# Altium project Solens.PrjPCB
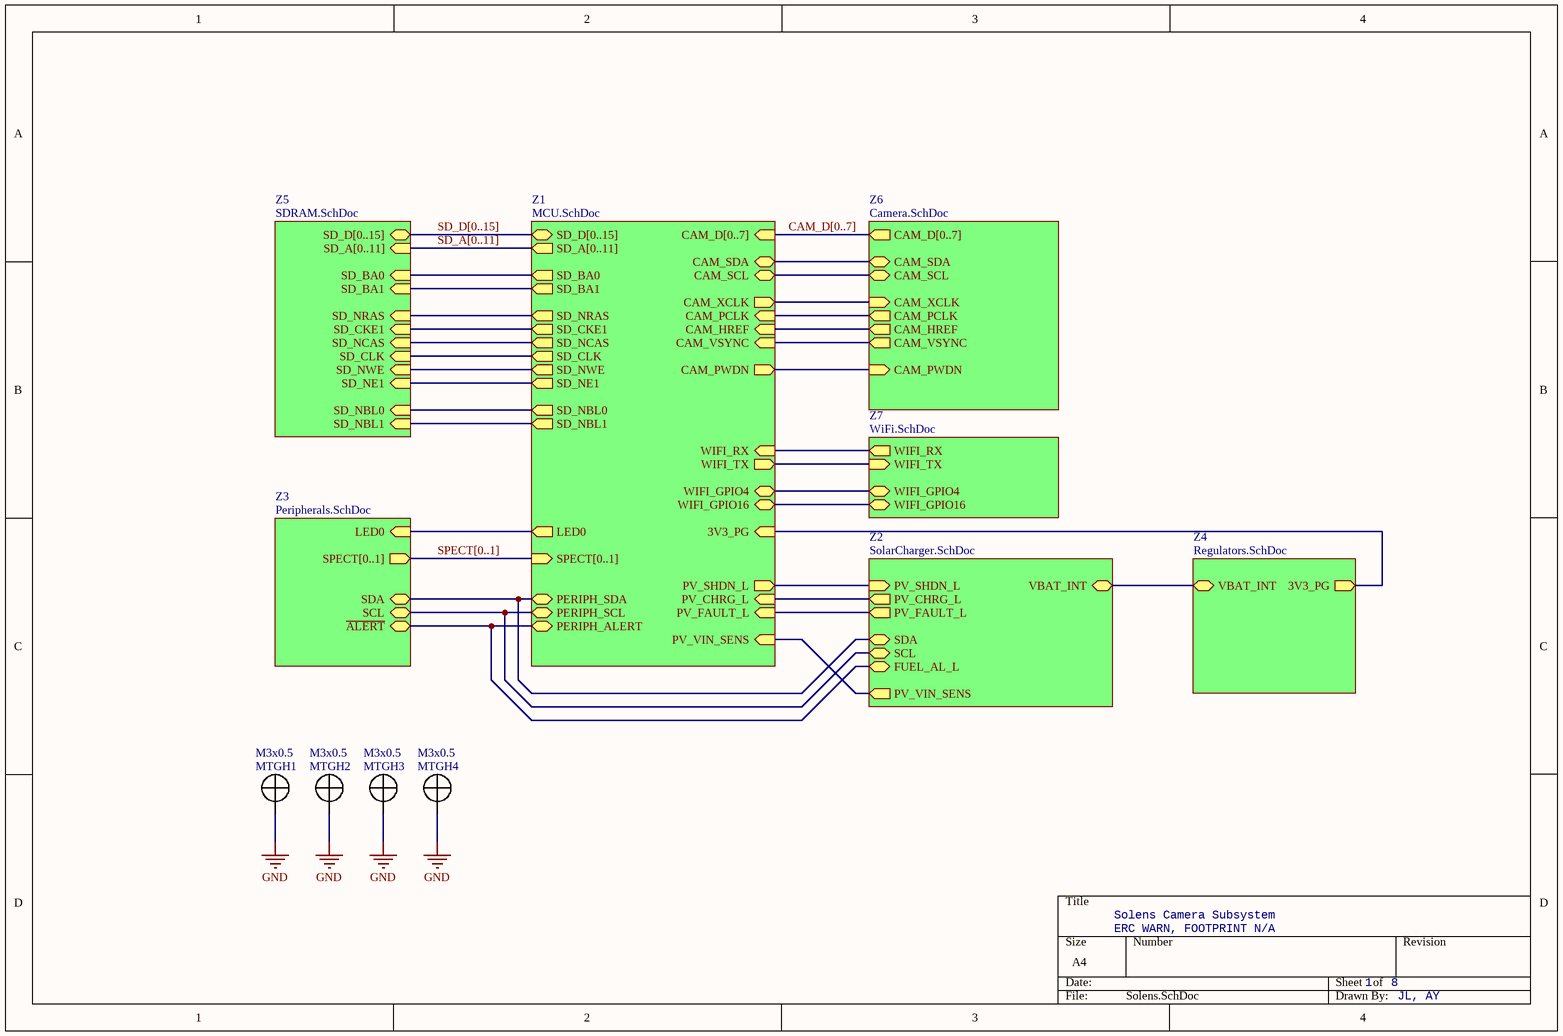
[diagram p0: Solens.SchDoc]
8 sheets, 208 parts. Net scope: hierarchical (ports join the sheet entries above them; power ports are global).
Board file: Solens.PcbDoc
Sheets:
  Solens.SchDoc
    Z2 = SolarCharger.SchDoc
    Z4 = Regulators.SchDoc
    Z5 = SDRAM.SchDoc
    Z1 = MCU.SchDoc
    Z3 = Peripherals.SchDoc
    Z6 = Camera.SchDoc
    Z7 = WiFi.SchDoc

## Sheet Solens.SchDoc
size A4; DocumentNumber: 1; SheetNumber: 1; SheetTotal: 8

### Parts
MTGH1  ScrewSize: M3x0.5  [MTGH-M3x0.5-ClipSW]  (hidden comment: M3x0.5 (DNP))
MTGH2  ScrewSize: M3x0.5  [MTGH-M3x0.5-ClipNW]  (hidden comment: M3x0.5 (DNP))
MTGH3  ScrewSize: M3x0.5  [MTGH-M3x0.5-ClipNE]  (hidden comment: M3x0.5 (DNP))
MTGH4  ScrewSize: M3x0.5  [MTGH-M3x0.5]  (hidden comment: M3x0.5 (DNP))

### Sub-sheets
Z1 = MCU.SchDoc: CAM_SDA (bidir), CAM_SCL (bidir), CAM_XCLK (out), CAM_PCLK (in), CAM_HREF (in), SD_NBL0 (out), SD_NBL1 (out), SD_NRAS (out), SD_CKE1 (out), SD_NCAS (out), SD_CLK (out), SD_NWE (out), SD_NE1 (out), SD_BA1 (out), SD_BA0 (out), CAM_VSYNC (in), CAM_PWDN (out), PERIPH_SDA (bidir), PERIPH_ALERT (bidir), PERIPH_SCL (bidir), WIFI_RX (in), WIFI_TX (out), PV_FAULT_L (in), PV_CHRG_L (in), 3V3_PG (in), PV_SHDN_L (out), SD_D[0..15] (bidir), SD_A[0..11] (out), CAM_D[0..7] (in), SPECT[0..1] (in), LED0 (out), PV_VIN_SENS (in), WIFI_GPIO16 (bidir), WIFI_GPIO4 (bidir)
Z2 = SolarCharger.SchDoc: SCL (bidir), SDA (bidir), PV_FAULT_L (out), PV_CHRG_L (out), PV_SHDN_L (in), FUEL_AL_L (bidir), VBAT_INT, PV_VIN_SENS (out)
Z3 = Peripherals.SchDoc: SDA (bidir), ~{ALERT} (bidir), SCL (bidir), SPECT[0..1] (out), LED0 (in)
Z4 = Regulators.SchDoc: 3V3_PG (out), VBAT_INT
Z5 = SDRAM.SchDoc: SD_BA0 (in), SD_BA1 (in), SD_NE1 (in), SD_NWE (in), SD_NRAS (in), SD_NCAS (in), SD_CLK (in), SD_CKE1 (in), SD_NBL1 (in), SD_NBL0 (in), SD_D[0..15] (bidir), SD_A[0..11] (in)
Z6 = Camera.SchDoc: CAM_PCLK (out), CAM_XCLK (in), CAM_HREF (out), CAM_VSYNC (out), CAM_PWDN (in), CAM_SDA (bidir), CAM_SCL (bidir), CAM_D[0..7] (out)
Z7 = WiFi.SchDoc: WIFI_TX (in), WIFI_RX (out), WIFI_GPIO4 (bidir), WIFI_GPIO16 (bidir)

### Nets
GND: MTGH1.1 MTGH2.1 MTGH3.1 MTGH4.1
3V3_PG: sheet Z4/3V3_PG, sheet Z1/3V3_PG
CAM_HREF: sheet Z1/CAM_HREF, sheet Z6/CAM_HREF
CAM_PCLK: sheet Z1/CAM_PCLK, sheet Z6/CAM_PCLK
CAM_PWDN: sheet Z1/CAM_PWDN, sheet Z6/CAM_PWDN
CAM_SCL: sheet Z1/CAM_SCL, sheet Z6/CAM_SCL
CAM_SDA: sheet Z1/CAM_SDA, sheet Z6/CAM_SDA
CAM_VSYNC: sheet Z1/CAM_VSYNC, sheet Z6/CAM_VSYNC
CAM_XCLK: sheet Z1/CAM_XCLK, sheet Z6/CAM_XCLK
I2C2_ALERT: sheet Z2/FUEL_AL_L, sheet Z1/PERIPH_ALERT, sheet Z3/~{ALERT}
I2C2_SCL: sheet Z2/SCL, sheet Z1/PERIPH_SCL, sheet Z3/SCL
I2C2_SDA: sheet Z2/SDA, sheet Z1/PERIPH_SDA, sheet Z3/SDA
LED0: sheet Z1/LED0, sheet Z3/LED0
PV_SHDN_L: sheet Z2/PV_SHDN_L, sheet Z1/PV_SHDN_L
PV_VIN_SENS: sheet Z2/PV_VIN_SENS, sheet Z1/PV_VIN_SENS
PWR_CHRG_L: sheet Z2/PV_CHRG_L, sheet Z1/PV_CHRG_L
PWR_FAULT_L: sheet Z2/PV_FAULT_L, sheet Z1/PV_FAULT_L
SD_BA0: sheet Z5/SD_BA0, sheet Z1/SD_BA0
SD_BA1: sheet Z5/SD_BA1, sheet Z1/SD_BA1
SD_CKE1: sheet Z5/SD_CKE1, sheet Z1/SD_CKE1
SD_CLK: sheet Z5/SD_CLK, sheet Z1/SD_CLK
SD_NBL0: sheet Z5/SD_NBL0, sheet Z1/SD_NBL0
SD_NBL1: sheet Z5/SD_NBL1, sheet Z1/SD_NBL1
SD_NCAS: sheet Z5/SD_NCAS, sheet Z1/SD_NCAS
SD_NE1: sheet Z5/SD_NE1, sheet Z1/SD_NE1
SD_NRAS: sheet Z5/SD_NRAS, sheet Z1/SD_NRAS
SD_NWE: sheet Z5/SD_NWE, sheet Z1/SD_NWE
VBAT_INT: sheet Z2/VBAT_INT, sheet Z4/VBAT_INT
WIFI_GPIO4: sheet Z1/WIFI_GPIO4, sheet Z7/WIFI_GPIO4
WIFI_GPIO16: sheet Z1/WIFI_GPIO16, sheet Z7/WIFI_GPIO16
WIFI_RX: sheet Z1/WIFI_RX, sheet Z7/WIFI_RX
WIFI_TX: sheet Z1/WIFI_TX, sheet Z7/WIFI_TX

### Buses and harness runs
bus CAM_D[0..7] = sheet Z1/CAM_D[0..7] = sheet Z6/CAM_D[0..7]
bus SD_A[0..11] = sheet Z1/SD_A[0..11] = sheet Z5/SD_A[0..11]
bus SD_D[0..15] = sheet Z1/SD_D[0..15] = sheet Z5/SD_D[0..15]
bus SPECT[0..1] = sheet Z1/SPECT[0..1] = sheet Z3/SPECT[0..1]

### Notes on the sheet
- Solens Camera Subsystem
- ERC WARN, FOOTPRINT N/A
- JL, AY

### Library data of the parts
MTGH1-MTGH4 = MTGH: Mounting hole; DigikeyPN: 36-9923-ND; DNP: DNP; Value: M3x0.5 (DNP)

## Sheet SolarCharger.SchDoc
size A4; DocumentNumber: 2; SheetNumber: 2; SheetTotal: 8
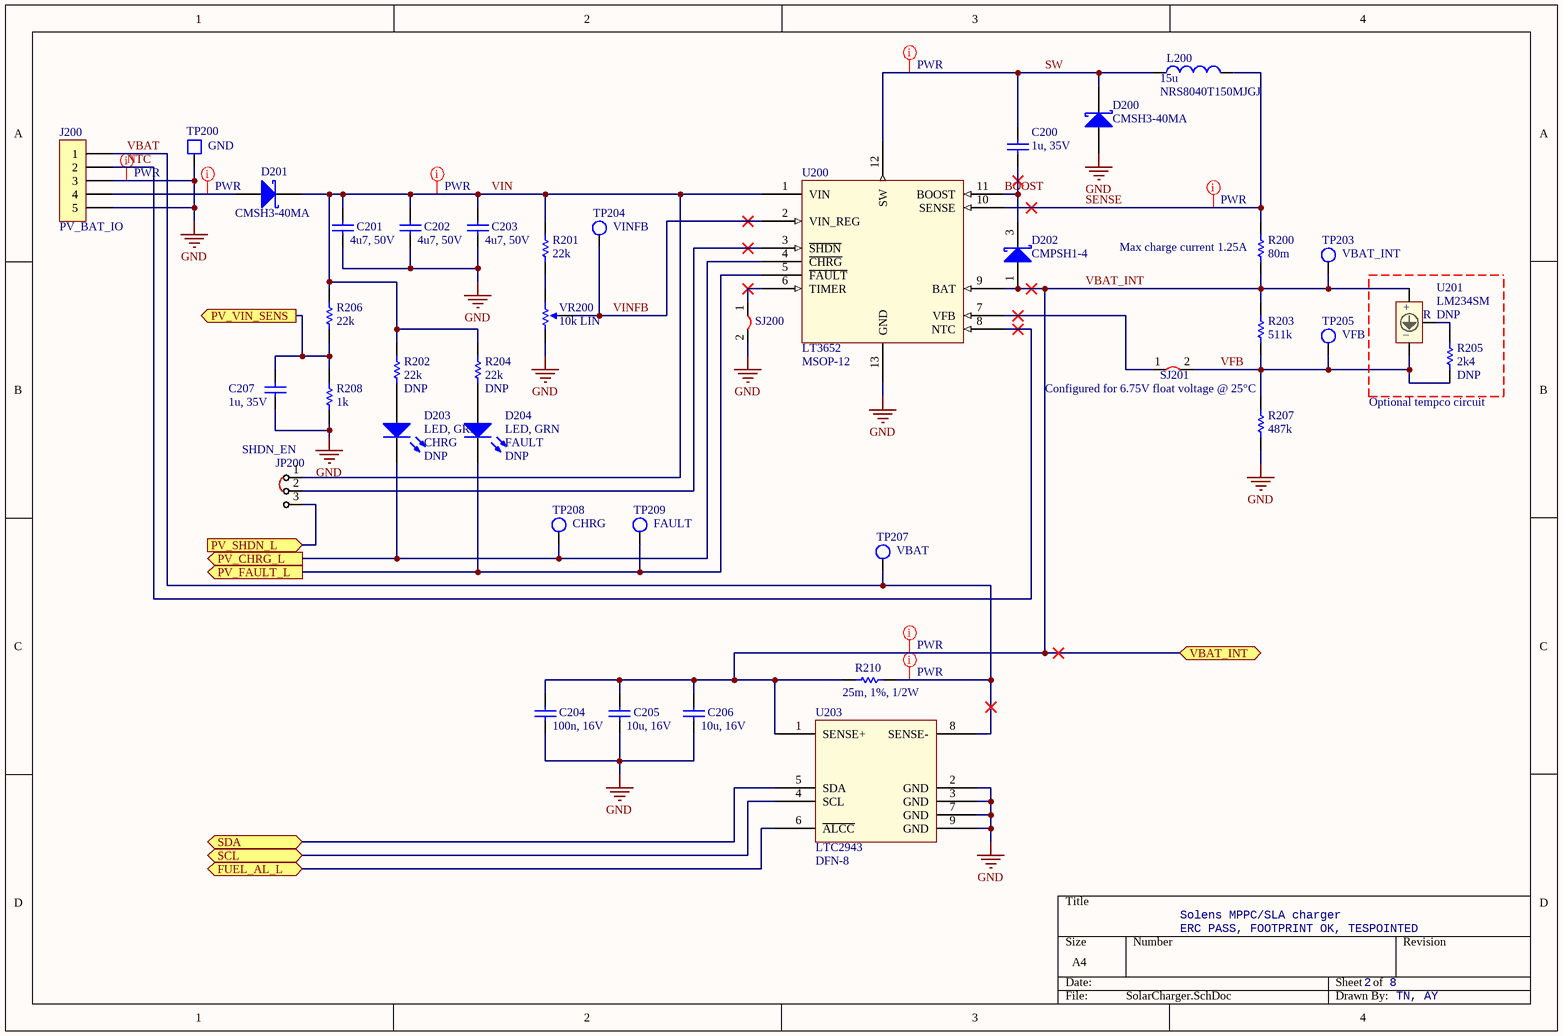
[diagram p1: SolarCharger.SchDoc]

### Parts
C200  value 1u, 35V  [CAP_0805]  (hidden comment: 1u, 35V, 0805)
C201  value 4u7, 50V  [CAP_1210]  (hidden comment: 4u7, 50V, 1210)
C202  value 4u7, 50V  [CAP_1210]  (hidden comment: 4u7, 50V, 1210)
C203  value 4u7, 50V  [CAP_1210]  (hidden comment: 4u7, 50V, 1210)
C204  value 100n, 16V  [CAP_0402]  (hidden comment: 100n, 16V, 0402)
C205  value 10u, 16V  [CAP_1206]  (hidden comment: 10u, 16V, 1206)
C206  value 10u, 16V  [CAP_1206]  (hidden comment: 10u, 16V, 1206)
C207  value 1u, 35V  [CAP_0805]  (hidden comment: 1u, 35V, 0805 (DNP))
D200  PartNumber: CMSH3-40MA  [SODFL519X262-2N (CMSH3-40MA)]  (hidden comment: CMSH3-40MA, DO-214AC)
D201  PartNumber: CMSH3-40MA  [SODFL519X262-2N (CMSH3-40MA)]  (hidden comment: CMSH3-40MA, DO-214AC)
D202  PartNumber: CMPSH1-4  [SOT95P240X100-3N (CMPSH1-4 TR)]  (hidden comment: CMPSH1-4, SOT-23F)
D203  value LED, GRN  Function: CHRG  [LED_0603]  (hidden comment: LED, GRN, 0603 (DNP))
D204  value LED, GRN  Function: FAULT  [LED_0603]  (hidden comment: LED, GRN, 0603 (DNP))
J200  Function: PV_BAT_IO  [691322110005]  (hidden comment: 691322110005, 5p 3.5mm Euro)
JP200  Function: SHDN_EN  [HDR_100TH_1x3]  (hidden comment: HDR_1x3_100TH_THT)
L200  value 15u  [IND_TAIYO_NRS804]  (hidden comment: NRS8040T150MJGJ)
R200  value 80m  [RES_1206]  (hidden comment: 80m, 1/4W, 1%, 1206)
R201  value 22k  [RES_0805]  (hidden comment: 22k, 1/8W, 0805)
R202  value 22k  [RES_0805]  (hidden comment: 22k, 1/8W, 0805)
R203  value 511k  [RES_0805]  (hidden comment: 511k, 1/8W, 0805)
R204  value 22k  [RES_0805]  (hidden comment: 22k, 1/8W, 0805)
R205  value 2k4  [RES_0805]  (hidden comment: 2k4, 1/8W, 0805 (DNP))
R206  value 22k  [RES_0805]  (hidden comment: 22k, 1/8W, 0805)
R207  value 487k  [RES_0805]  (hidden comment: 487k, 1/8W, 0805)
R208  value 1k  [RES_0805]  (hidden comment: 1k, 1/8W, 0805)
R210  value 25m, 1%, 1/2W  [RES_1206]  (hidden comment: 25m, 1/2W, 1%, 1206)
SJ200  SJ, 0805 (DNP)  [SJ_0805]  (value not drawn)
SJ201  SJ, 0805 (DNP)  [SJ_0805]  (value not drawn)
TP200  VisibleNetName: GND  [TP_LARGE]  (hidden comment: TP (DNP))
TP203  VisibleNetName: VBAT_INT  [TP_SMALL]  (hidden comment: TP (DNP))
TP204  VisibleNetName: VINFB  [TP_SMALL]  (hidden comment: TP (DNP))
TP205  VisibleNetName: VFB  [TP_SMALL]  (hidden comment: TP (DNP))
TP207  VisibleNetName: VBAT  [TP_SMALL]  (hidden comment: TP (DNP))
TP208  VisibleNetName: CHRG  [TP_SMALL]  (hidden comment: TP (DNP))
TP209  VisibleNetName: FAULT  [TP_SMALL]  (hidden comment: TP (DNP))
U200  PackageName: MSOP-12  [TSOP65P490X110_HS-13N (LT3652)]  (hidden comment: LT3652, MSOP-12)
U201  value LM234SM  [SOIC127P600X175-8N (LM234)]  (hidden comment: LM234SM, SOIC-8 (DNP))
U203  PartNumber: LTC2943  PackageName: DFN-8  [DFN8-3x3]  (hidden comment: LTC2943, DFN-8)
VR200  value 10k LIN  [RES_3361P]  (hidden comment: 3361P-1-103GLF)

### Ports
FUEL_AL_L (bidir), PV_CHRG_L (out), PV_FAULT_L (out), PV_SHDN_L (in), PV_VIN_SENS (out), SCL (bidir), SDA (bidir), VBAT_INT

### Nets
GND: C201.2 C202.2 C203.2 C204.2 C205.2 C206.2 C207.2 D200.1(A) J200.3 J200.5 R207.2 R208.2 SJ200.2 TP200.1 U200.13(GND) U203.2(GND) U203.3(GND) U203.7(GND) U203.9(GND) VR200.2
BOOST: C200.2 D202.3(K) U200.11(BOOST)
I2C2_ALERT: U203.6(~{ALCC}) ; port FUEL_AL_L
I2C2_SCL: U203.4(SCL) ; port SCL
I2C2_SDA: U203.5(SDA) ; port SDA
NTC: J200.2 U200.8(NTC)
PV_SHDN_L: JP200.3 ; port PV_SHDN_L
PV_VIN_SENS: C207.1 R206.2 R208.1 ; port PV_VIN_SENS
PWR_CHRG_L: D203.2(K) TP208.1 U200.4(~{CHRG}) ; port PV_CHRG_L
PWR_FAULT_L: D204.2(K) TP209.1 U200.5(~{FAULT}) ; port PV_FAULT_L
SENSE: L200.2 R200.2 U200.10(SENSE)
SW: C200.1 D200.2(K) L200.1 U200.12(SW)
VBAT: J200.1 R210.2 TP207.1 U203.8(SENSE-)
VBAT_INT: C204.1 C205.1 C206.1 D202.1(A) R200.1 R203.1 R210.1 TP203.1 U200.9(BAT) U201.3(V+) U203.1(SENSE+) ; port VBAT_INT
VFB: R203.2 R205.2 R207.1 SJ201.2 TP205.1 U201.1(V-)
VIN: C201.1 C202.1 C203.1 D201.2(K) JP200.1 R201.1 R202.1 R204.1 R206.1 U200.1(VIN)
VINFB: TP204.1 U200.2(VIN_REG) VR200.3
NetD201_1: D201.1(A) J200.4
NetD203_1: D203.1(A) R202.2
NetD204_1: D204.1(A) R204.2
NetJP200_2: JP200.2 U200.3(~{SHDN})
NetR201_2: R201.2 VR200.1
NetR205_1: R205.1 U201.2(R)
NetSJ200_1: SJ200.1 U200.6(TIMER)
NetSJ201_1: SJ201.1 U200.7(VFB)

### Layout directives
net class PWR: GND, NetD201_1, SENSE, SW, VBAT, VBAT_INT, VIN

### Notes on the sheet
- (near R200) Max charge current 1.25A
- Configured for 6.75V float voltage @ 25°C
- (near R205) Optional tempco circuit
- Solens MPPC/SLA charger
- ERC PASS, FOOTPRINT OK, TESPOINTED
- TN, AY
- (in symbol LM234) +; –

### Library data of the parts
C200-C207 = Cap: Capacitor
  C200: DigikeyPN: 1276-6470-1-ND
  C201-C203: DigikeyPN: 1276-3343-1-ND
  C204: DigikeyPN: 587-3498-1-ND
  C205 C206: DigikeyPN: 1276-1312-1-ND
  C207: DigikeyPN: 1276-6470-1-ND; DNP: DNP
D200-D202 = D Schottky: Schottky Diode
  D200 D201: PackageName: DO-214AC (SMA); DigikeyPN: CMSH3-40MA TR13CT-ND; Value: CMSH3-40MA
  D202: PackageName: SOT-23F; DigikeyPN: CMPSH1-4 CT-ND; Value: CMPSH1-4
D203 D204 = LED0: DigikeyPN: 732-4971-1-ND; DNP: DNP
J200 = 691322110005: WR-TBL Terminal block - serie 3221 - 3.50 mm; Manufacturer: Würth Elektronik eiSos GmbH; ComponentLink1 Description: Manufacturer; ComponentLink2 Description: Datasheet; NoPins: 5; Created Date: 9 December 2013; ComponentLink1URL: http://www.we-online.com; ComponentLink2URL: http://katalog.we-online.de/em/datasheet/6913221100xx.pdf; Created by: Karrer Zheng; DigikeyPN: 732-2772-ND; PartNumber: 691322110005; Value: 691322110005
JP200 = JP-3: 3-pos Jumper; DigikeyPN: 732-5316-ND; Value: HDR_1x3_100TH_THT
L200 = Inductor: PartNumber: NRS8040T150MJGJ; DigikeyPN: 587-2973-1-ND
R200-R208 R210 = Res1: Resistor
  R200: DigikeyPN: WSLC-.08CT-ND
  R201: DigikeyPN: 311-22.0KCRCT-ND
  R202 R204 R206: DigikeyPN: 311-22.0KCRCT-ND; DNP: DNP
  R203: DigikeyPN: 311-511KCRCT-ND
  R205: DNP: DNP
  R207: DigikeyPN: 311-487KCRCT-ND
  R208: DigikeyPN: 311-1.00KCRCT-ND; DNP: DNP
  R210: DigikeyPN: CSR1206FK25L0CT-ND
SJ200 SJ201 = SJ: Solder jumper; Value: SJ_0805 (DNP); DNP: DNP
TP200 = TP_LARGE: Value: TP_LARGE (DNP); DigikeyPN: 36-5016CT-ND; DNP: DNP
TP203-TP205 TP207-TP209 = TP_SMALL: Value: TP_SMALL (DNP); DigikeyPN: 36-5015CT-ND; DNP: DNP
U200 = LT3652: MPPC and battery charger; PartNumber: LT3652; DigikeyPN: LT3652EMSE#PBF-ND; Value: LT3652
U201 = LM234: Adjustable current source; PartNumber: LM234SM; PackageName: SOIC-8; DigikeyPN: 497-1549-1-ND; DNP: DNP
U203 = LTC2943A: Multi-cell I2C fuel gauge; DigikeyPN: LTC2943IDD#PBF-ND; Value: LTC2943
VR200 = TrimPot: Function: VIN SET; DigikeyPN: 3361P-103GLFCT-ND; PartNumber: 3361P-1-103GLF

## Sheet Regulators.SchDoc
size A4; DocumentNumber: 3; SheetNumber: 3; SheetTotal: 8
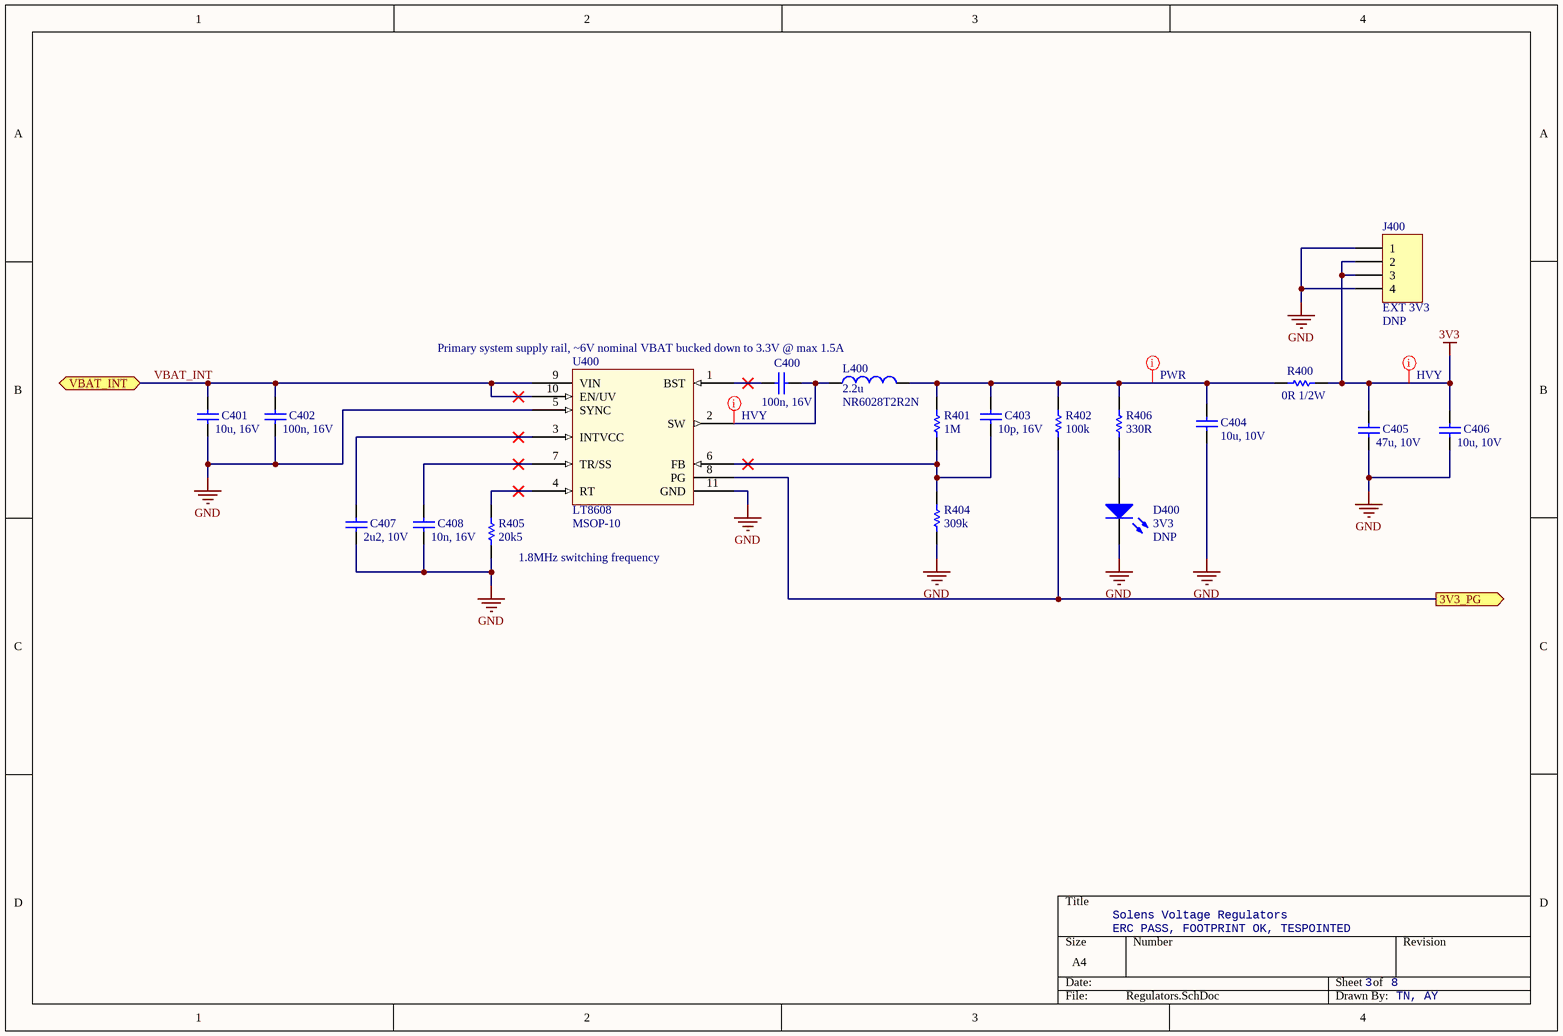
[diagram p2: Regulators.SchDoc]

### Parts
C400  value 100n, 16V  [CAP_0402]  (hidden comment: 100n, 16V, 0402)
C401  value 10u, 16V  [CAP_1206]  (hidden comment: 10u, 16V, 1206)
C402  value 100n, 16V  [CAP_0402]  (hidden comment: 100n, 16V, 0402)
C403  value 10p, 16V  [CAP_0805]  (hidden comment: 10p, 16V, 0805)
C404  value 10u, 10V  [CAP_0805]  (hidden comment: 10u, 10V, 0805)
C405  value 47u, 10V  [CAP_1206]  (hidden comment: 47u, 10V, 1206)
C406  value 10u, 10V  [CAP_0805]  (hidden comment: 10u, 10V, 0805)
C407  value 2u2, 10V  [CAP_0805]  (hidden comment: 2u2, 10V, 0805)
C408  value 10n, 16V  [CAP_0805]  (hidden comment: 10n, 16V, 0805)
D400  Function: 3V3  [LED_0603]  (hidden comment: LED, RED, 0603 (DNP))
J400  Function: EXT 3V3  [HDR1X4]  (hidden comment: HDR_1x4_100TH_THT (DNP))
L400  value 2.2u  [IND_TAIYO_NR6028]  (hidden comment: NR6028T2R2N)
R400  value 0R 1/2W  [RES_1206]  (hidden comment: 0R, 1/2W, 1206)
R401  value 1M  [RES_0805]  (hidden comment: 1M, 1/8W, 0805)
R402  value 100k  [RES_0805]  (hidden comment: 100k, 1/8W, 0805)
R404  value 309k  [RES_0805]  (hidden comment: 309k, 1/8W, 0805)
R405  value 20k5  [RES_0805]  (hidden comment: 20k5, 1/8W, 0805)
R406  value 330R  [RES_0805]  (hidden comment: 330, 1/8W, 0805)
U400  PackageName: MSOP-10  [TSSOP50P490X110_HS-11N]  (hidden comment: LT8608, MSOP-10)

### Ports
3V3_PG (out), VBAT_INT

### Nets
3V3: C405.1 C406.2 J400.2 J400.3 R400.1
GND: C401.2 C402.2 C404.1 C405.2 C406.1 C407.2 C408.2 D400.2(K) J400.1 J400.4 R404.1 R405.2 U400.5(SYNC) U400.11(GND)
3V3_PG: R402.1 U400.8(PG) ; port 3V3_PG
VBAT_INT: C401.1 C402.1 U400.9(VIN) U400.10(EN/UV) ; port VBAT_INT
NetC400_1: C400.1 U400.1(BST)
NetC400_2: C400.2 L400.1 U400.2(SW)
NetC403_1: C403.1 R401.1 R404.2 U400.6(FB)
NetC403_2: C403.2 C404.2 L400.2 R400.2 R401.2 R402.2 R406.2
NetC407_1: C407.1 U400.3(INTVCC)
NetC408_1: C408.1 U400.7(TR/SS)
NetD400_1: D400.1(A) R406.1
NetR405_1: R405.1 U400.4(RT)

### Layout directives
net class PWR: NetC403_2
net class HVY: 3V3, NetC400_2

### Notes on the sheet
- Primary system supply rail, ~6V nominal VBAT bucked down to 3.3V @ max 1.5A
- (near R405) 1.8MHz switching frequency
- Solens Voltage Regulators
- ERC PASS, FOOTPRINT OK, TESPOINTED
- TN, AY

### Library data of the parts
C400-C408 = Cap: Capacitor
  C400 C402: DigikeyPN: 587-3498-1-ND
  C401: DigikeyPN: 1276-1312-1-ND
  C403: DigikeyPN: 1276-1109-1-ND
  C404 C406: DigikeyPN: 1276-6455-1-ND
  C405: DigikeyPN: 1276-3063-1-ND
  C407: DigikeyPN: 1276-6458-1-ND
  C408: DigikeyPN: 1276-1015-1-ND
D400 = LED0: DigikeyPN: 732-4978-1-ND; DNP: DNP; Value: LED, RED
J400 = Header 4: Header, 4-Pin; DigikeyPN: 732-5317-ND; DNP: DNP; Value: HDR_1x4_100TH_THT
L400 = Inductor: PartNumber: NR6028T2R2N; DigikeyPN: 587-2098-1-ND
R400-R402 R404-R406 = Res1: Resistor
  R400: DigikeyPN: 36-5106CT-ND
  R401: DigikeyPN: 311-1.00MCRCT-ND
  R402: DigikeyPN: 311-100KCRCT-ND
  R404: DigikeyPN: 311-309KCRCT-ND
  R405: DigikeyPN: 311-20.5KCRCT-ND
  R406: DigikeyPN: 311-330CRCT-ND
U400 = LT8608: 42V 1.5A step-down, low Iq; PartNumber: LT8608; DigikeyPN: LT8608IMSE#PBF-ND; Value: LT8608

## Sheet SDRAM.SchDoc
size A4; DocumentNumber: 4; SheetNumber: 4; SheetTotal: 8
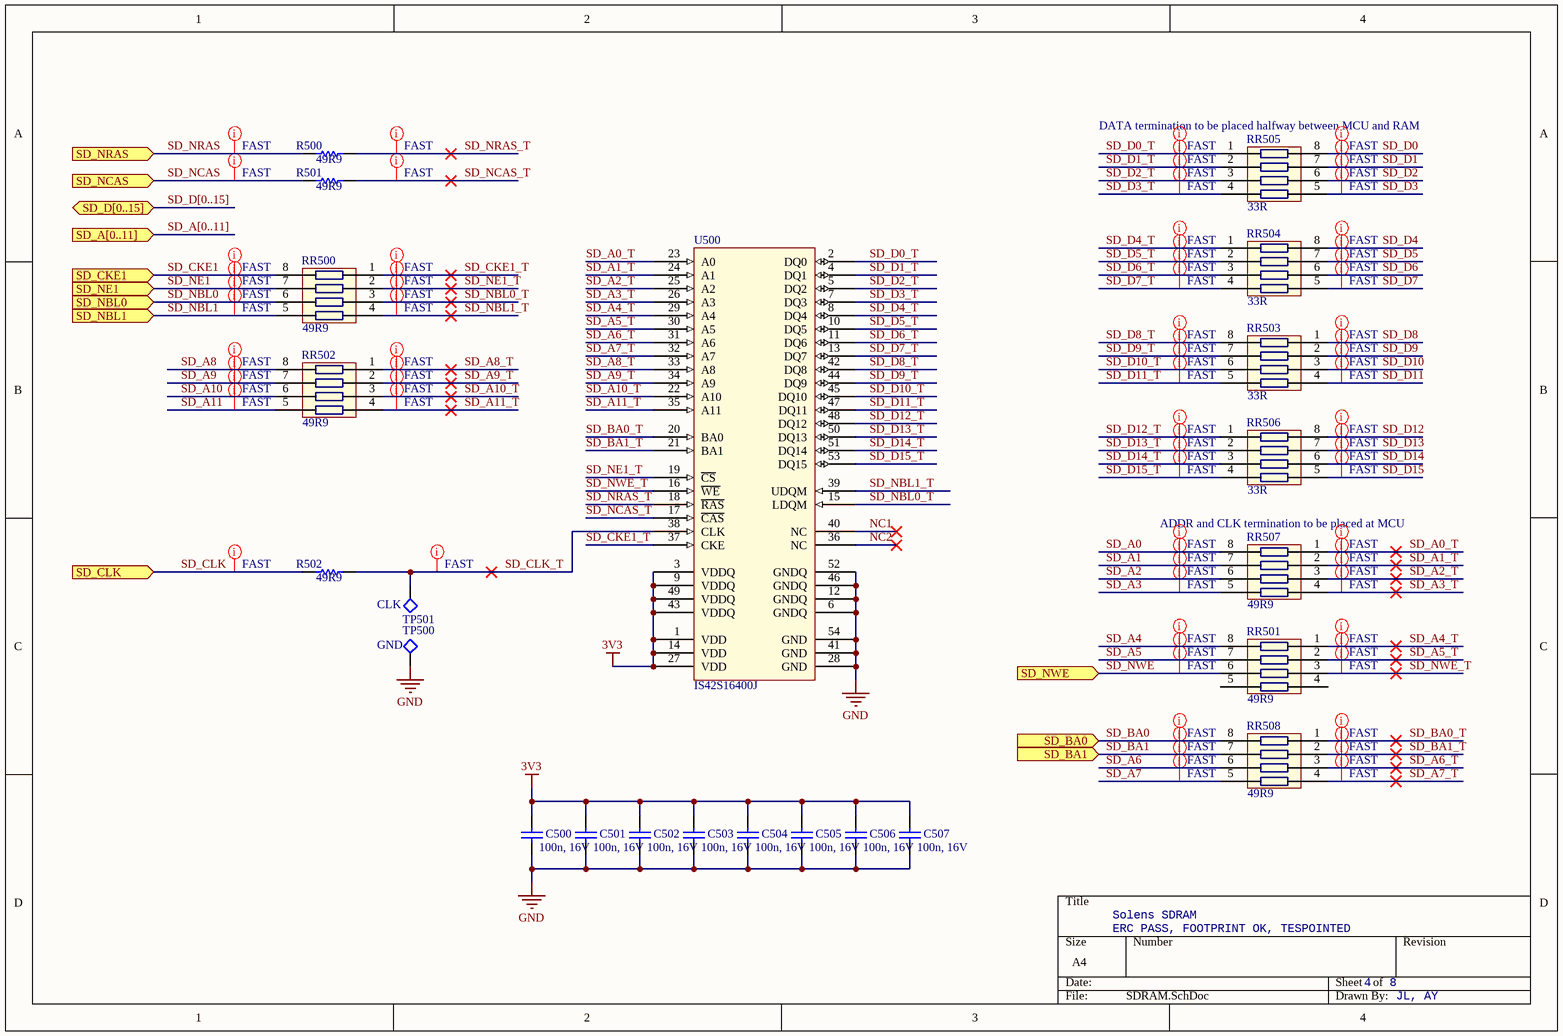
[diagram p3: SDRAM.SchDoc]

### Parts
C500  value 100n, 16V  [CAP_0402]  (hidden comment: 100n, 16V, 0402)
C501  value 100n, 16V  [CAP_0402]  (hidden comment: 100n, 16V, 0402)
C502  value 100n, 16V  [CAP_0402]  (hidden comment: 100n, 16V, 0402)
C503  value 100n, 16V  [CAP_0402]  (hidden comment: 100n, 16V, 0402)
C504  value 100n, 16V  [CAP_0402]  (hidden comment: 100n, 16V, 0402)
C505  value 100n, 16V  [CAP_0402]  (hidden comment: 100n, 16V, 0402)
C506  value 100n, 16V  [CAP_0402]  (hidden comment: 100n, 16V, 0402)
C507  value 100n, 16V  [CAP_0402]  (hidden comment: 100n, 16V, 0402)
R500  value 49R9  [RES_0805]  (hidden comment: 49R9, 1/8W, 0805)
R501  value 49R9  [RES_0805]  (hidden comment: 49R9, 1/8W, 0805)
R502  value 49R9  [RES_0805]  (hidden comment: 49R9, 1/8W, 0805)
RR500  value 49R9  [CAC-80P319X150-8M]  (hidden comment: CRA6S849.9ACT-ND)
RR501  value 49R9  [CAC-80P319X150-8M]  (hidden comment: CRA6S849.9ACT-ND)
RR502  value 49R9  [CAC-80P319X150-8M]  (hidden comment: CRA6S849.9ACT-ND)
RR503  value 33R  [CAC-80P319X150-8M]  (hidden comment: CRA6S833CT-ND)
RR504  value 33R  [CAC-80P319X150-8M]  (hidden comment: CRA6S833CT-ND)
RR505  value 33R  [CAC-80P319X150-8M]  (hidden comment: CRA6S833CT-ND)
RR506  value 33R  [CAC-80P319X150-8M]  (hidden comment: CRA6S833CT-ND)
RR507  value 49R9  [CAC-80P319X150-8M]  (hidden comment: CRA6S849.9ACT-ND)
RR508  value 49R9  [CAC-80P319X150-8M]  (hidden comment: CRA6S849.9ACT-ND)
TP500  VisibleNetName: GND  [TP_TINY]  (hidden comment: TP (DNP))
TP501  VisibleNetName: CLK  [TP_TINY]  (hidden comment: TP (DNP))
U500  IS42S16400J, TSOP-54  [TSOP80P1170X120-54N]  (value not drawn)

### Ports
SD_A[0..11] (in), SD_BA0 (in), SD_BA1 (in), SD_CKE1 (in), SD_CLK (in), SD_D[0..15] (bidir), SD_NBL0 (in), SD_NBL1 (in), SD_NCAS (in), SD_NE1 (in), SD_NRAS (in), SD_NWE (in)

### Nets
3V3: C500.1 C501.1 C502.1 C503.1 C504.1 C505.1 C506.1 C507.1 U500.1(VDD) U500.3(VDDQ) U500.9(VDDQ) U500.14(VDD) U500.27(VDD) U500.43(VDDQ) U500.49(VDDQ)
GND: C500.2 C501.2 C502.2 C503.2 C504.2 C505.2 C506.2 C507.2 TP500.1 U500.6(GNDQ) U500.12(GNDQ) U500.28(GND) U500.41(GND) U500.46(GNDQ) U500.52(GNDQ) U500.54(GND)
NC1: U500.40(NC)
NC2: U500.36(NC)
SD_A0: RR507.8(1B)
SD_A0_T: RR507.1(1A) U500.23(A0)
SD_A1: RR507.7(2B)
SD_A1_T: RR507.2(2A) U500.24(A1)
SD_A2: RR507.6(3B)
SD_A2_T: RR507.3(3A) U500.25(A2)
SD_A3: RR507.5(4B)
SD_A3_T: RR507.4(4A) U500.26(A3)
SD_A4: RR501.8(1B)
SD_A4_T: RR501.1(1A) U500.29(A4)
SD_A5: RR501.7(2B)
SD_A5_T: RR501.2(2A) U500.30(A5)
SD_A6: RR508.6(3B)
SD_A6_T: RR508.3(3A) U500.31(A6)
SD_A7: RR508.5(4B)
SD_A7_T: RR508.4(4A) U500.32(A7)
SD_A8: RR502.8(1B)
SD_A8_T: RR502.1(1A) U500.33(A8)
SD_A9: RR502.7(2B)
SD_A9_T: RR502.2(2A) U500.34(A9)
SD_A10: RR502.6(3B)
SD_A10_T: RR502.3(3A) U500.22(A10)
SD_A11: RR502.5(4B)
SD_A11_T: RR502.4(4A) U500.35(A11)
SD_BA0: RR508.8(1B) ; port SD_BA0
SD_BA0_T: RR508.1(1A) U500.20(BA0)
SD_BA1: RR508.7(2B) ; port SD_BA1
SD_BA1_T: RR508.2(2A) U500.21(BA1)
SD_CKE1: RR500.8(1B) ; port SD_CKE1
SD_CKE1_T: RR500.1(1A) U500.37(CKE)
SD_CLK: R502.1 ; port SD_CLK
SD_CLK_T: R502.2 TP501.1 U500.38(CLK)
SD_D0: RR505.8(1B)
SD_D0_T: RR505.1(1A) U500.2(DQ0)
SD_D1: RR505.7(2B)
SD_D1_T: RR505.2(2A) U500.4(DQ1)
SD_D2: RR505.6(3B)
SD_D2_T: RR505.3(3A) U500.5(DQ2)
SD_D3: RR505.5(4B)
SD_D3_T: RR505.4(4A) U500.7(DQ3)
SD_D4: RR504.8(1B)
SD_D4_T: RR504.1(1A) U500.8(DQ4)
SD_D5: RR504.7(2B)
SD_D5_T: RR504.2(2A) U500.10(DQ5)
SD_D6: RR504.6(3B)
SD_D6_T: RR504.3(3A) U500.11(DQ6)
SD_D7: RR504.5(4B)
SD_D7_T: RR504.4(4A) U500.13(DQ7)
SD_D8: RR503.1(1A)
SD_D8_T: RR503.8(1B) U500.42(DQ8)
SD_D9: RR503.2(2A)
SD_D9_T: RR503.7(2B) U500.44(DQ9)
SD_D10: RR503.3(3A)
SD_D10_T: RR503.6(3B) U500.45(DQ10)
SD_D11: RR503.4(4A)
SD_D11_T: RR503.5(4B) U500.47(DQ11)
SD_D12: RR506.8(1B)
SD_D12_T: RR506.1(1A) U500.48(DQ12)
SD_D13: RR506.7(2B)
SD_D13_T: RR506.2(2A) U500.50(DQ13)
SD_D14: RR506.6(3B)
SD_D14_T: RR506.3(3A) U500.51(DQ14)
SD_D15: RR506.5(4B)
SD_D15_T: RR506.4(4A) U500.53(DQ15)
SD_NBL0: RR500.6(3B) ; port SD_NBL0
SD_NBL0_T: RR500.3(3A) U500.15(LDQM)
SD_NBL1: RR500.5(4B) ; port SD_NBL1
SD_NBL1_T: RR500.4(4A) U500.39(UDQM)
SD_NCAS: R501.1 ; port SD_NCAS
SD_NCAS_T: R501.2 U500.17(~{CAS})
SD_NE1: RR500.7(2B) ; port SD_NE1
SD_NE1_T: RR500.2(2A) U500.19(~{CS})
SD_NRAS: R500.1 ; port SD_NRAS
SD_NRAS_T: R500.2 U500.18(~{RAS})
SD_NWE: RR501.6(3B) ; port SD_NWE
SD_NWE_T: RR501.3(3A) U500.16(~{WE})

Not connected (* = marked no-connect by the designer): RR501 4(4A) 5(4B)

### Buses and harness runs
bus SD_A[0..11] = port SD_A[0..11]
bus SD_D[0..15] = port SD_D[0..15]

### Layout directives
net class FAST: SD_A0, SD_A0_T, SD_A1, SD_A1_T, SD_A2, SD_A2_T, SD_A3, SD_A3_T, SD_A4, SD_A4_T, SD_A5, SD_A5_T, SD_A6, SD_A6_T, SD_A7, SD_A7_T, SD_A8, SD_A8_T, SD_A9, SD_A9_T, SD_A10, SD_A10_T, SD_A11, SD_A11_T, SD_BA0, SD_BA0_T, SD_BA1, SD_BA1_T, SD_CKE1, SD_CKE1_T, SD_CLK, SD_CLK_T, SD_D0, SD_D0_T, SD_D1, SD_D1_T, SD_D2, SD_D2_T, SD_D3, SD_D3_T, SD_D4, SD_D4_T, SD_D5, SD_D5_T, SD_D6, SD_D6_T, SD_D7, SD_D7_T, SD_D8, SD_D8_T, SD_D9, SD_D9_T, SD_D10, SD_D10_T, SD_D11, SD_D11_T, SD_D12, SD_D12_T, SD_D13, SD_D13_T, SD_D14, SD_D14_T, SD_D15, SD_D15_T, SD_NBL0, SD_NBL0_T, SD_NBL1, SD_NBL1_T, SD_NCAS, SD_NCAS_T, SD_NE1, SD_NE1_T, SD_NRAS, SD_NRAS_T, SD_NWE, SD_NWE_T

### Notes on the sheet
- (near RR505) DATA termination to be placed halfway between MCU and RAM
- (near RR507) ADDR and CLK termination to be placed at MCU
- Solens SDRAM
- ERC PASS, FOOTPRINT OK, TESPOINTED
- JL, AY

### Library data of the parts
C500-C507 = Cap: Capacitor; DigikeyPN: 587-3498-1-ND
R500-R502 = Res1: Resistor; DigikeyPN: 311-49.9CRCT-ND
RR500-RR508 = RES_ARR_4: 4 element resistor array
  RR500-RR502 RR507 RR508: DigikeyPN: CRA6S849.9ACT-ND
  RR503-RR506: DigikeyPN: CRA6S833CT-ND
TP500 TP501 = TP_TINY: Value: TP_TINY (DNP); DNP: DNP
U500 = IS42S16400J: 1Mb x 16 x 4 bank (64 Mbit) SDRAM; PartNumber: IS42S16400J; PackageName: TSOP-54; DigikeyPN: 706-1132-ND; Value: IS42S16400J

## Sheet MCU.SchDoc
size A4; DocumentNumber: 5; SheetNumber: 5; SheetTotal: 8
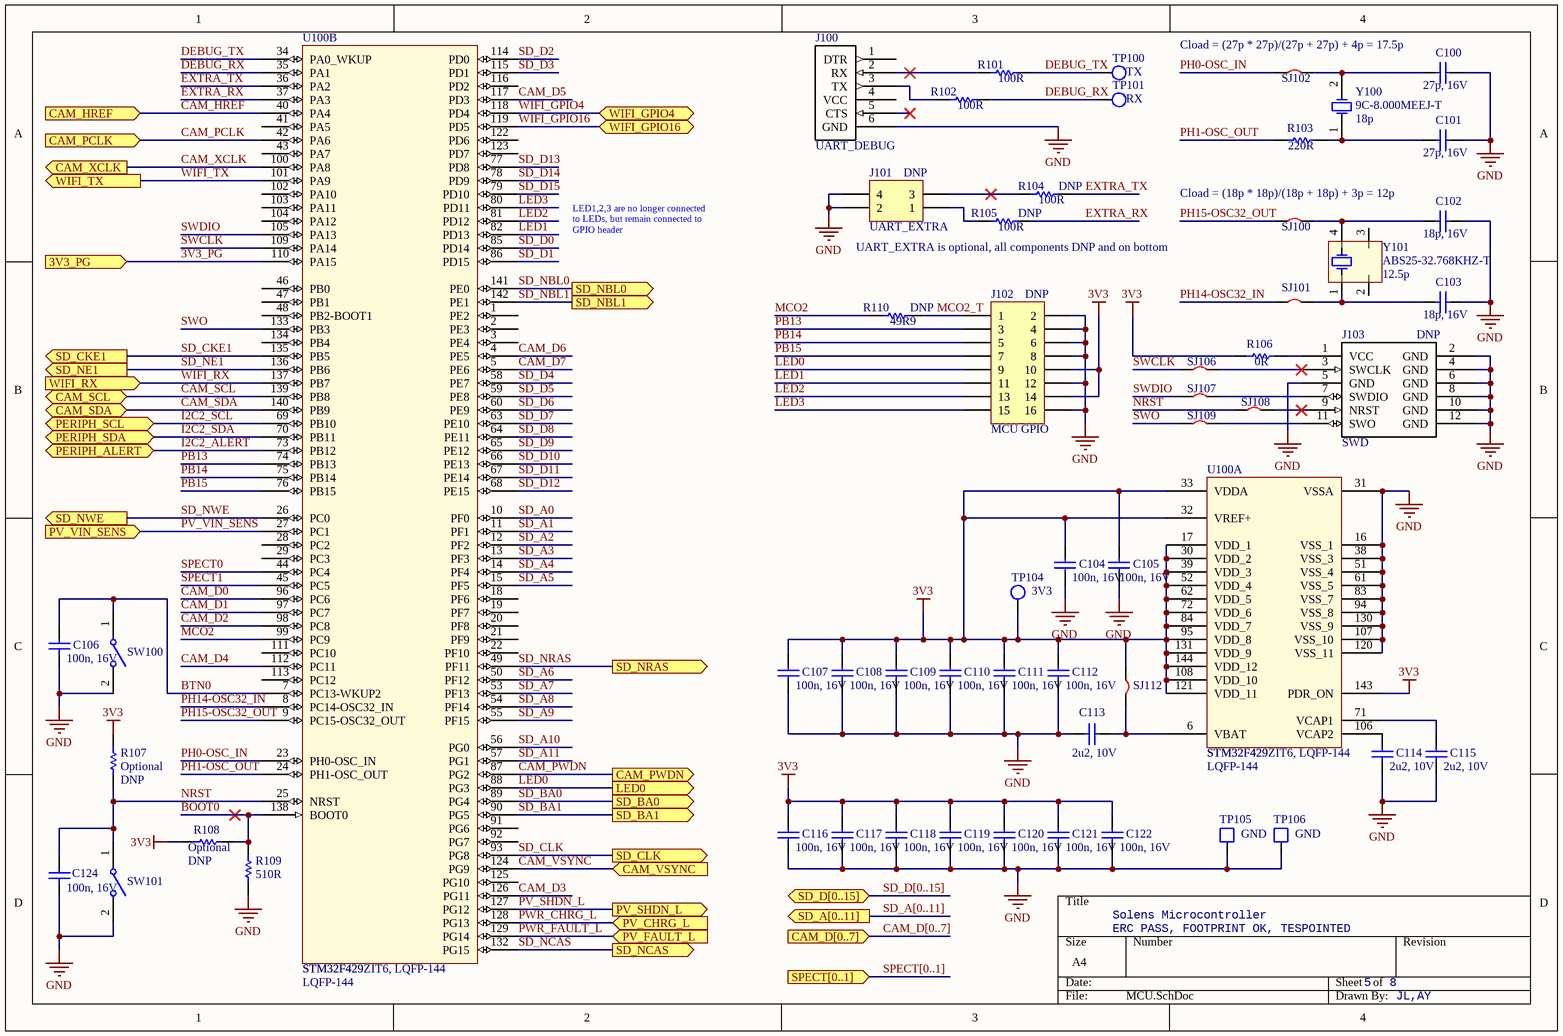
[diagram p4: MCU.SchDoc]

### Parts
C100  value 27p, 16V  [CAP_0402]  (hidden comment: 27p, 16V, 0402)
C101  value 27p, 16V  [CAP_0402]  (hidden comment: 27p, 16V, 0402)
C102  value 18p, 16V  [CAP_0402]  (hidden comment: 18p, 16V, 0402)
C103  value 18p, 16V  [CAP_0402]  (hidden comment: 18p, 16V, 0402)
C104  value 100n, 16V  [CAP_0402]  (hidden comment: 100n, 16V, 0402)
C105  value 100n, 16V  [CAP_0402]  (hidden comment: 100n, 16V, 0402)
C106  value 100n, 16V  [CAP_0402]  (hidden comment: 100n, 16V, 0402)
C107  value 100n, 16V  [CAP_0402]  (hidden comment: 100n, 16V, 0402)
C108  value 100n, 16V  [CAP_0402]  (hidden comment: 100n, 16V, 0402)
C109  value 100n, 16V  [CAP_0402]  (hidden comment: 100n, 16V, 0402)
C110  value 100n, 16V  [CAP_0402]  (hidden comment: 100n, 16V, 0402)
C111  value 100n, 16V  [CAP_0402]  (hidden comment: 100n, 16V, 0402)
C112  value 100n, 16V  [CAP_0402]  (hidden comment: 100n, 16V, 0402)
C113  value 2u2, 10V  [CAP_0805]  (hidden comment: 2u2, 10V, 0805)
C114  value 2u2, 10V  [CAP_0805]  (hidden comment: 2u2, 10V, 0805)
C115  value 2u2, 10V  [CAP_0805]  (hidden comment: 2u2, 10V, 0805)
C116  value 100n, 16V  [CAP_0402]  (hidden comment: 100n, 16V, 0402)
C117  value 100n, 16V  [CAP_0402]  (hidden comment: 100n, 16V, 0402)
C118  value 100n, 16V  [CAP_0402]  (hidden comment: 100n, 16V, 0402)
C119  value 100n, 16V  [CAP_0402]  (hidden comment: 100n, 16V, 0402)
C120  value 100n, 16V  [CAP_0402]  (hidden comment: 100n, 16V, 0402)
C121  value 100n, 16V  [CAP_0402]  (hidden comment: 100n, 16V, 0402)
C122  value 100n, 16V  [CAP_0402]  (hidden comment: 100n, 16V, 0402)
C124  value 100n, 16V  [CAP_0402]  (hidden comment: 100n, 16V, 0402)
J100  Function: UART_DEBUG  [HDR_100TH_1x6]  (hidden comment: HDR_1x6_100TH_THT)
J101  Function: UART_EXTRA  [HDR_100TH_2X2_SMT]  (hidden comment: HDR_2x2_100TH_SMT (DNP))
J102  Function: MCU GPIO  [HDR_100TH_2X8_SMT]  (hidden comment: HDR_2x8_100TH_SMT (DNP))
J103  Function: SWD  [HDR_100TH_2X6_SMT]  (hidden comment: HDR_2x8_100TH_SMT)
R101  value 100R  [RES_0805]  (hidden comment: 100R, 1/8W, 0805)
R102  value 100R  [RES_0805]  (hidden comment: 100R, 1/8W, 0805)
R103  value 220R  [RES_0805]  (hidden comment: 220R, 1/8W, 0805)
R104  value 100R  [RES_0805]  (hidden comment: 100R, 1/8W, 0805 (DNP))
R105  value 100R  [RES_0805]  (hidden comment: 100R, 1/8W, 0805 (DNP))
R106  value 0R  [RES_0805]  (hidden comment: 0R, 1/8W, 0805 (DNP))
R107  value Optional  [RES_0805]  (hidden comment: 0R, 1/8W, 0805 (DNP))
R108  value Optional  [RES_0805]  (hidden comment: 0805 (DNP))
R109  value 510R  [RES_0805]  (hidden comment: 510R, 1/8W, 0805)
R110  value 49R9  [RES_0805]  (hidden comment: 49R9, 1/8W, 0805 (DNP))
SJ100  SJ, 0805 (DNP)  [SJ_0805]  (value not drawn)
SJ101  SJ, 0805 (DNP)  [SJ_0805]  (value not drawn)
SJ102  SJ, 0805 (DNP)  [SJ_0805]  (value not drawn)
SJ106  SJ, 0805 (DNP)  [SJ_0805]  (value not drawn)
SJ107  SJ, 0805 (DNP)  [SJ_0805]  (value not drawn)
SJ108  SJ, 0805 (DNP)  [SJ_0805]  (value not drawn)
SJ109  SJ, 0805 (DNP)  [SJ_0805]  (value not drawn)
SJ112  SJ, 0805 (DNP)  [SJ_0805]  (value not drawn)
SW100  434121043816, TACT SPST NO  [4341x10438x6]  (value not drawn)
SW101  434121043816, TACT SPST NO  [4341x10438x6]  (value not drawn)
TP100  VisibleNetName: TX  [TP_SMALL]  (hidden comment: TP (DNP))
TP101  VisibleNetName: RX  [TP_SMALL]  (hidden comment: TP (DNP))
TP104  VisibleNetName: 3V3  [TP_SMALL]  (hidden comment: TP (DNP))
TP105  VisibleNetName: GND  [TP_LARGE]  (hidden comment: TP (DNP))
TP106  VisibleNetName: GND  [TP_LARGE]  (hidden comment: TP (DNP))
U100  STM32F429ZIT6, LQFP-144  PackageName: LQFP-144  [TSQFP50P2200X2200X160-144M]  (parts A,B of 2)
Y100  LoadCapacitance: 18p  [HC-49S]  (hidden comment: 9C-8.000MEEJ-T)
Y101  LoadCapacitance: 12.5p  [XTAL-SOJ-4]  (hidden comment: ABS25-32.768KHZ-T)

### Ports
3V3_PG (in), CAM_D[0..7] (in), CAM_HREF (in), CAM_PCLK (in), CAM_PWDN (out), CAM_SCL (bidir), CAM_SDA (bidir), CAM_VSYNC (in), CAM_XCLK (out), LED0 (out), PERIPH_ALERT (bidir), PERIPH_SCL (bidir), PERIPH_SDA (bidir), PV_CHRG_L (in), PV_FAULT_L (in), PV_SHDN_L (out), PV_VIN_SENS (in), SD_A[0..11] (out), SD_BA0 (out), SD_BA1 (out), SD_CKE1 (out), SD_CLK (out), SD_D[0..15] (bidir), SD_NBL0 (out), SD_NBL1 (out), SD_NCAS (out), SD_NE1 (out), SD_NRAS (out), SD_NWE (out), SPECT[0..1] (in), WIFI_GPIO4 (bidir), WIFI_GPIO16 (bidir), WIFI_RX (in), WIFI_TX (out)

### Nets
3V3: C104.1 C105.1 C107.1 C108.1 C109.1 C110.1 C111.1 C112.1 C116.1 C117.1 C118.1 C119.1 C120.1 C121.1 C122.1 J102.10 J102.14 R106.1 R107.1 R108.1 SJ112.1 TP104.1 U100.17(VDD_1) U100.30(VDD_2) U100.32(VREF+) U100.33(VDDA) U100.39(VDD_3) U100.52(VDD_4) U100.62(VDD_5) U100.72(VDD_6) U100.84(VDD_7) U100.95(VDD_8) U100.108(VDD_10) U100.121(VDD_11) U100.131(VDD_9) U100.143(PDR_ON) U100.144(VDD_12)
GND: C100.2 C101.2 C102.2 C103.2 C104.2 C105.2 C106.2 C107.2 C108.2 C109.2 C110.2 C111.2 C112.2 C113.1 C114.2 C115.2 C116.2 C117.2 C118.2 C119.2 C120.2 C121.2 C122.2 C124.2 J100.6(GND) J101.2 J101.4 J102.2 J102.4 J102.6 J102.8 J102.12 J102.16 J103.2(GND) J103.4(GND) J103.5(GND) J103.6(GND) J103.8(GND) J103.10(GND) J103.12(GND) R109.2 SW100.2 SW101.2 TP105.1 TP106.1 U100.16(VSS_1) U100.31(VSSA) U100.38(VSS_3) U100.51(VSS_4) U100.61(VSS_5) U100.83(VSS_7) U100.94(VSS_8) U100.107(VSS_10) U100.120(VSS_11) U100.130(VSS_9)
3V3_PG: U100.110(PA15) ; port 3V3_PG
BOOT0: R108.2 R109.1 U100.138(BOOT0)
BTN0: C106.1 SW100.1 U100.7(PC13-WKUP2)
CAM_D0: U100.96(PC6)
CAM_D1: U100.97(PC7)
CAM_D2: U100.98(PC8)
CAM_D3: U100.126(PG11)
CAM_D4: U100.112(PC11)
CAM_D5: U100.117(PD3)
CAM_D6: U100.4(PE5)
CAM_D7: U100.5(PE6)
CAM_HREF: U100.40(PA4) ; port CAM_HREF
CAM_PCLK: U100.42(PA6) ; port CAM_PCLK
CAM_PWDN: U100.87(PG2) ; port CAM_PWDN
CAM_SCL: U100.139(PB8) ; port CAM_SCL
CAM_SDA: U100.140(PB9) ; port CAM_SDA
CAM_VSYNC: U100.124(PG9) ; port CAM_VSYNC
CAM_XCLK: U100.100(PA8) ; port CAM_XCLK
DEBUG_RX: R102.2 TP101.1 U100.35(PA1)
DEBUG_TX: R101.2 TP100.1 U100.34(PA0_WKUP)
EXTRA_RX: R105.2 U100.37(PA3)
EXTRA_TX: R104.2 U100.36(PA2)
I2C2_ALERT: U100.73(PB12) ; port PERIPH_ALERT
I2C2_SCL: U100.69(PB10) ; port PERIPH_SCL
I2C2_SDA: U100.70(PB11) ; port PERIPH_SDA
LED0: J102.9 U100.88(PG3) ; port LED0
LED1: J102.11 U100.82(PD13)
LED2: J102.13 U100.81(PD12)
LED3: J102.15 U100.80(PD11)
MCO2: R110.1 U100.99(PC9)
MCO2_T: J102.1 R110.2
NRST: C124.1 R107.2 SJ108.1 SW101.1 U100.25(NRST)
PB13: J102.3 U100.74(PB13)
PB14: J102.5 U100.75(PB14)
PB15: J102.7 U100.76(PB15)
PH0-OSC_IN: SJ102.1 U100.23(PH0-OSC_IN)
PH1-OSC_OUT: R103.1 U100.24(PH1-OSC_OUT)
PH14-OSC32_IN: SJ101.1 U100.8(PC14-OSC32_IN)
PH15-OSC32_OUT: SJ100.1 U100.9(PC15-OSC32_OUT)
PV_SHDN_L: U100.127(PG12) ; port PV_SHDN_L
PV_VIN_SENS: U100.27(PC1) ; port PV_VIN_SENS
PWR_CHRG_L: U100.128(PG13) ; port PV_CHRG_L
PWR_FAULT_L: U100.129(PG14) ; port PV_FAULT_L
SD_A0: U100.10(PF0)
SD_A1: U100.11(PF1)
SD_A2: U100.12(PF2)
SD_A3: U100.13(PF3)
SD_A4: U100.14(PF4)
SD_A5: U100.15(PF5)
SD_A6: U100.50(PF12)
SD_A7: U100.53(PF13)
SD_A8: U100.54(PF14)
SD_A9: U100.55(PF15)
SD_A10: U100.56(PG0)
SD_A11: U100.57(PG1)
SD_BA0: U100.89(PG4) ; port SD_BA0
SD_BA1: U100.90(PG5) ; port SD_BA1
SD_CKE1: U100.135(PB5) ; port SD_CKE1
SD_CLK: U100.93(PG8) ; port SD_CLK
SD_D0: U100.85(PD14)
SD_D1: U100.86(PD15)
SD_D2: U100.114(PD0)
SD_D3: U100.115(PD1)
SD_D4: U100.58(PE7)
SD_D5: U100.59(PE8)
SD_D6: U100.60(PE9)
SD_D7: U100.63(PE10)
SD_D8: U100.64(PE11)
SD_D9: U100.65(PE12)
SD_D10: U100.66(PE13)
SD_D11: U100.67(PE14)
SD_D12: U100.68(PE15)
SD_D13: U100.77(PD8)
SD_D14: U100.78(PD9)
SD_D15: U100.79(PD10)
SD_NBL0: U100.141(PE0) ; port SD_NBL0
SD_NBL1: U100.142(PE1) ; port SD_NBL1
SD_NCAS: U100.132(PG15) ; port SD_NCAS
SD_NE1: U100.136(PB6) ; port SD_NE1
SD_NRAS: U100.49(PF11) ; port SD_NRAS
SD_NWE: U100.26(PC0) ; port SD_NWE
SPECT0: U100.44(PC4)
SPECT1: U100.45(PC5)
SWCLK: SJ106.1 U100.109(PA14)
SWDIO: SJ107.1 U100.105(PA13)
SWO: SJ109.1 U100.133(PB3)
WIFI_GPIO4: U100.118(PD4) ; port WIFI_GPIO4
WIFI_GPIO16: U100.119(PD5) ; port WIFI_GPIO16
WIFI_RX: U100.137(PB7) ; port WIFI_RX
WIFI_TX: U100.101(PA9) ; port WIFI_TX
NetC100_1: C100.1 SJ102.2 Y100.2(OSC2)
NetC101_1: C101.1 R103.2 Y100.1(OSC1)
NetC102_1: C102.1 SJ100.2 Y101.4
NetC103_1: C103.1 SJ101.2 Y101.1
NetC113_2: C113.2 SJ112.2 U100.6(VBAT)
NetC114_1: C114.1 U100.106(VCAP2)
NetC115_1: C115.1 U100.71(VCAP1)
NetJ100_2: J100.2(RX) R101.1
NetJ100_3: J100.3(TX) R102.1
NetJ101_1: J101.1 R105.1
NetJ101_3: J101.3 R104.1
NetJ103_1: J103.1(VCC) R106.2
NetJ103_3: J103.3(SWCLK) SJ106.2
NetJ103_7: J103.7(SWDIO) SJ107.2
NetJ103_9: J103.9(NRST) SJ108.2
NetJ103_11: J103.11(SWO) SJ109.2

Not connected (* = marked no-connect by the designer): J100 1(DTR) 4(VCC) 5(CTS)*; U100 1(PE2) 2(PE3) 3(PE4) 18(PF6) 19(PF7) 20(PF8) 21(PF9) 22(PF10) 28(PC2) 29(PC3) 41(PA5) 43(PA7) 46(PB0) 47(PB1) 48(PB2-BOOT1) 91(PG6) 92(PG7) 102(PA10) 103(PA11) 104(PA12) 111(PC10) 113(PC12) 116(PD2) 122(PD6) 123(PD7) 125(PG10) 134(PB4); Y101 2 3

### Buses and harness runs
bus CAM_D[0..7] = port CAM_D[0..7]
bus SD_A[0..11] = port SD_A[0..11]
bus SD_D[0..15] = port SD_D[0..15]
bus SPECT[0..1] = port SPECT[0..1]

### Notes on the sheet
- Cload = (27p * 27p)/(27p + 27p) + 4p = 17.5p
- LED1,2,3 are no longer connected
  to LEDs, but remain connected to
  GPIO header
- UART_EXTRA is optional, all components DNP and on bottom
- Cload = (18p * 18p)/(18p + 18p) + 3p = 12p
- Solens Microcontroller
- ERC PASS, FOOTPRINT OK, TESPOINTED
- JL,AY

### Library data of the parts
C100-C122 C124 = Cap: Capacitor
  C100 C101: DigikeyPN: 1276-1153-1-ND
  C102 C103: DigikeyPN: 490-6203-1-ND
  C104-C112 C116-C122 C124: DigikeyPN: 587-3498-1-ND
  C113-C115: DigikeyPN: 1276-6458-1-ND
J100 = HDR_FTDI: Sparkfun FTDI pinout connector; DigikeyPN: 609-3263-ND; Value: HDR_1x6_100TH_THT
J101 = Header 2X2: Header, 2-Pin, Dual row; DNP: DNP; DigikeyPN: WM9514-ND; Value: HDR_2x2_100TH_SMT
J102 = Header 8X2: Header, 8-Pin, Dual row; DigikeyPN: WM17454-ND; DNP: DNP; Value: HDR_2x8_100TH_SMT
J103 = HDR_SWD_2x6: 6 pin SWD connector with +6 GND pins; DigikeyPN: WM17452-ND; Value: HDR_2x8_100TH_SMT
R101-R110 = Res1: Resistor
  R101 R102: DigikeyPN: 311-100CRCT-ND
  R103: DigikeyPN: 311-220CRCT-ND
  R104 R105: DigikeyPN: 311-100CRCT-ND; DNP: DNP
  R106 R107: DNP: DNP; DigikeyPN: 311-0.0CRCT-ND
  R108: DNP: DNP
  R109: DigikeyPN: 311-510CRCT-ND
  R110: DigikeyPN: 311-49.9CRCT-ND; DNP: DNP
SJ100-SJ102 SJ106-SJ109 SJ112 = SJ: Solder jumper; Value: SJ_0805 (DNP); DNP: DNP
SW100 = WS-TASV, 434121043816: WS-TASV 6.0x3.5 mm SMD; Manufacturer: Wurth Elektronik; Function: MCU BTN0; PartNumber: 434121043816; ComponentLink1URL: http://www.we-online.de; Created by: Baojun Chen; Created Date: Dec.2015; ComponentLink2URL: http://katalog.we-online.de/em/datasheet/4341x1xxx8x6.pdf; DigikeyPN: 732-7046-1-ND; Value: 434121043816
SW101 = WS-TASV, 434121043816: WS-TASV 6.0x3.5 mm SMD; Manufacturer: Wurth Elektronik; Function: MCU RESET; PartNumber: 434121043816; ComponentLink1URL: http://www.we-online.de; Created by: Baojun Chen; Created Date: Dec.2015; ComponentLink2URL: http://katalog.we-online.de/em/datasheet/4341x1xxx8x6.pdf; DigikeyPN: 732-7046-1-ND; Value: 434121043816
TP100 TP101 TP104 = TP_SMALL: Value: TP_SMALL (DNP); DigikeyPN: 36-5015CT-ND; DNP: DNP
TP105 TP106 = TP_LARGE: Value: TP_LARGE (DNP); DigikeyPN: 36-5016CT-ND; DNP: DNP
U100 = STM32F429: Cortex-M4 microcontroller; PartNumber: STM32F429
Y100 = XTAL: Crystal Oscillator; Value: 8M000; PartNumber: 9C-8.000MEEJ-T; PackageName: HC-49S; DigikeyPN: 887-1263-1-ND
Y101 = XTAL-SOJ-4: Value: 32k768; PartNumber: ABS25-32.768KHZ-T; PackageName: SOJ-4; DigikeyPN: 535-9166-1-ND

## Sheet Peripherals.SchDoc
size A4; DocumentNumber: 6; SheetNumber: 6; SheetTotal: 8
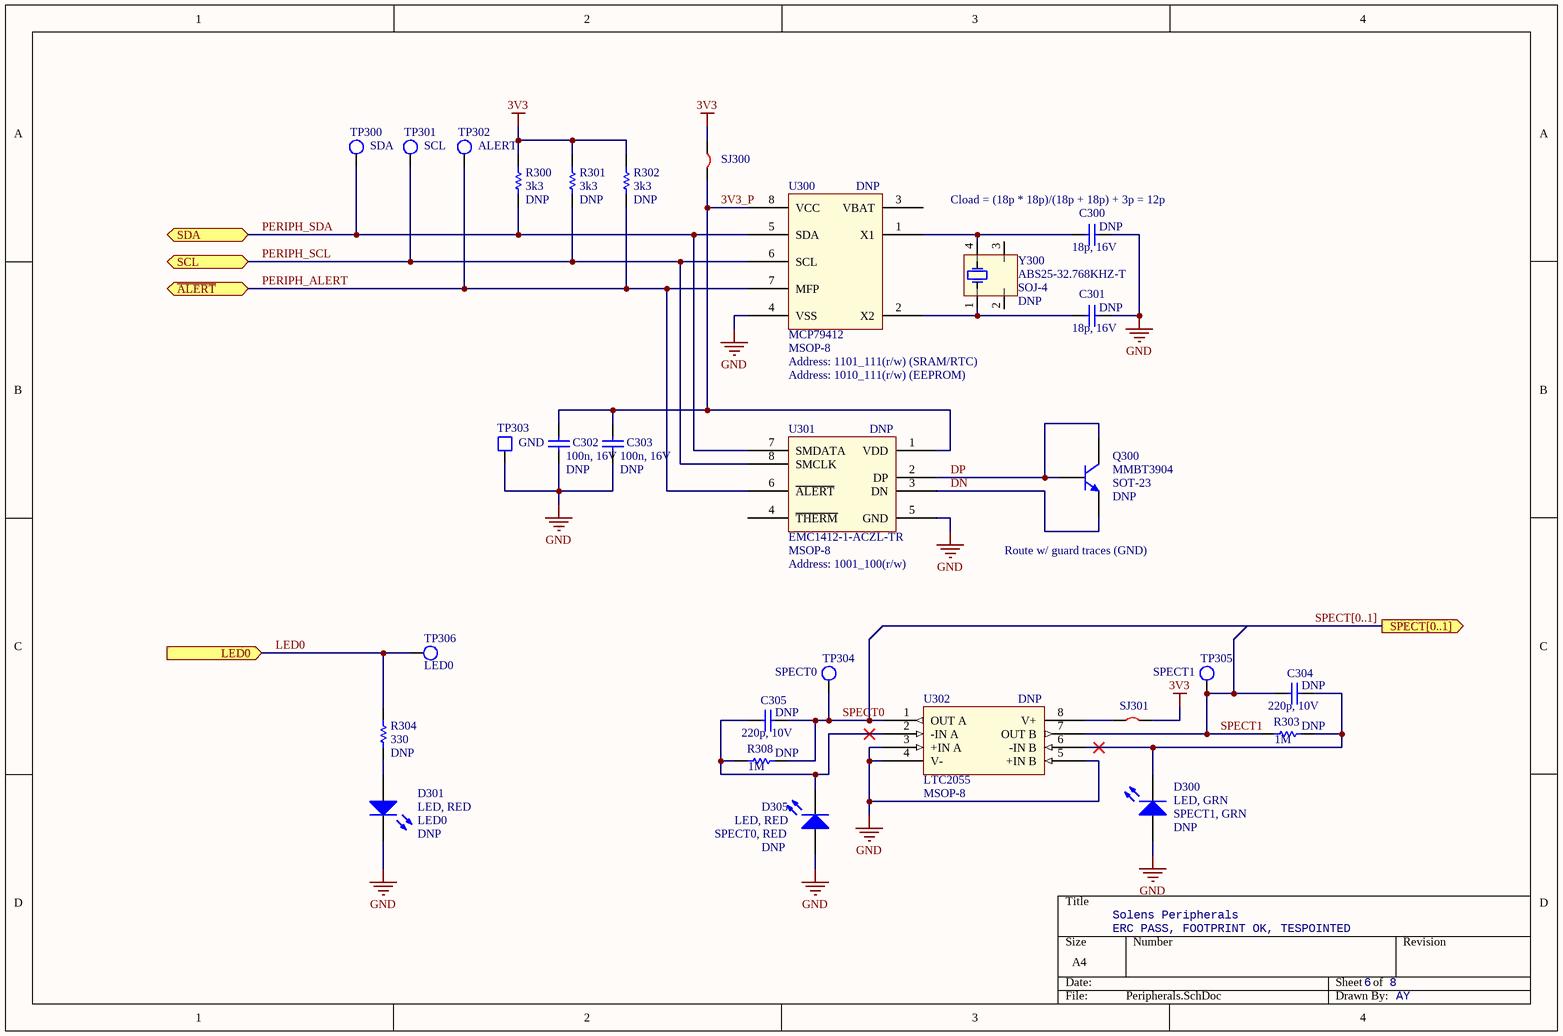
[diagram p5: Peripherals.SchDoc]

### Parts
C300  value 18p, 16V  [CAP_0402]  (hidden comment: 18p, 16V, 0402 (DNP))
C301  value 18p, 16V  [CAP_0402]  (hidden comment: 18p, 16V, 0402 (DNP))
C302  value 100n, 16V  [CAP_0402]  (hidden comment: 100n, 16V, 0402 (DNP))
C303  value 100n, 16V  [CAP_0402]  (hidden comment: 100n, 16V, 0402 (DNP))
C304  value 220p, 10V  [CAP_0402]  (hidden comment: 220p, 16V, 0402 (DNP))
C305  value 220p, 10V  [CAP_0402]  (hidden comment: 220p, 16V, 0402 (DNP))
D300  value LED, GRN  Function: SPECT1, GRN  [LED_0603]  (hidden comment: LED, GRN, 0603 (DNP))
D301  value LED, RED  [LED_0603]  (hidden comment: LED, RED, 0603 (DNP))
D305  value LED, RED  Function: SPECT0, RED  [LED_0603]  (hidden comment: LED, RED, 0603 (DNP))
Q300  PartNumber: MMBT3904  PackageName: SOT-23  [SOT90P240X110-3N]  (hidden comment: MMBT3904, SOT-23 (DNP))
R300  value 3k3  [RES_0805]  (hidden comment: 3k3, 1/8W, 0805 (DNP))
R301  value 3k3  [RES_0805]  (hidden comment: 3k3, 1/8W, 0805 (DNP))
R302  value 3k3  [RES_0805]  (hidden comment: 3k3, 1/8W, 0805 (DNP))
R303  value 1M  [RES_0402]  (hidden comment: 1M, 1/16W, 0402 (DNP))
R304  value 330  [RES_0805]  (hidden comment: 330, 1/8W, 0805 (DNP))
R308  value 1M  [RES_0402]  (hidden comment: 1M, 1/16W, 0402 (DNP))
SJ300  SJ, 0805 (DNP)  [SJ_0805]  (value not drawn)
SJ301  SJ, 0805 (DNP)  [SJ_0805]  (value not drawn)
TP300  VisibleNetName: SDA  [TP_SMALL]  (hidden comment: TP (DNP))
TP301  VisibleNetName: SCL  [TP_SMALL]  (hidden comment: TP (DNP))
TP302  VisibleNetName: ALERT  [TP_SMALL]  (hidden comment: TP (DNP))
TP303  VisibleNetName: GND  [TP_LARGE]  (hidden comment: TP (DNP))
TP304  VisibleNetName: SPECT0  [TP_SMALL]  (hidden comment: TP (DNP))
TP305  VisibleNetName: SPECT1  [TP_SMALL]  (hidden comment: TP (DNP))
TP306  VisibleNetName: LED0  [TP_SMALL]  (hidden comment: TP (DNP))
U300  PackageName: MSOP-8  PartNumber: MCP79412  [TSOP65P490X110-8N]  (hidden comment: MCP79412, MSOP-8 (DNP))
U301  PartNumber: EMC1412-1-ACZL-TR  PackageName: MSOP-8  [TSOP65P490X110-8N]  (hidden comment: EMC1412, MSOP-8 (DNP))
U302  PartNumber: LTC2055  PackageName: MSOP-8  [TSOP65P490X110-8N]  (hidden comment: LTC2055, MSOP-8 (DNP))
Y300  PartNumber: ABS25-32.768KHZ-T  PackageName: SOJ-4  [XTAL-SOJ-4]  (hidden comment: ABS25-32.768KHZ-T (DNP))

### Ports
LED0 (in), SCL (bidir), SDA (bidir), SPECT[0..1] (out), ~{ALERT} (bidir)

### Nets
3V3: R300.1 R301.1 R302.1 SJ300.1 SJ301.2
GND: C300.2 C301.2 C302.2 C303.2 D300.1(A) D301.2(K) D305.1(A) TP303.1 U300.4(VSS) U301.5(GND) U302.3(+IN_A) U302.4(V-) U302.5(+IN_B)
3V3_P: C302.1 C303.1 SJ300.2 U300.8(VCC) U301.1(VDD)
DN: Q300.1(E) U301.3(DN)
DP: Q300.2(B) Q300.3(C) U301.2(DP)
LED0: R304.1 TP306.1 ; port LED0
PERIPH_ALERT: R302.2 TP302.1 U300.7(MFP) U301.6(~{ALERT}) ; port ~{ALERT}  [project net I2C2_ALERT]
PERIPH_SCL: R301.2 TP301.1 U300.6(SCL) U301.8(SMCLK) ; port SCL  [project net I2C2_SCL]
PERIPH_SDA: R300.2 TP300.1 U300.5(SDA) U301.7(SMDATA) ; port SDA  [project net I2C2_SDA]
SPECT0: C305.2 R308.2 TP304.1 U302.1(OUT_A)
SPECT1: C304.1 R303.1 TP305.1 U302.7(OUT_B)
NetC300_1: C300.1 U300.1(X1) Y300.4
NetC301_1: C301.1 U300.2(X2) Y300.1
NetC304_2: C304.2 D300.2(K) R303.2 U302.6(-IN_B)
NetC305_1: C305.1 D305.2(K) R308.1 U302.2(-IN_A)
NetD301_1: D301.1(A) R304.2
NetSJ301_1: SJ301.1 U302.8(V+)

Not connected (* = marked no-connect by the designer): U300 3(VBAT); U301 4(~{THERM}); Y300 2 3

### Buses and harness runs
bus SPECT[0..1] = port SPECT[0..1]

### Notes on the sheet
- (near C300) Cload = (18p * 18p)/(18p + 18p) + 3p = 12p
- (near U300) Address: 1101_111(r/w) (SRAM/RTC)
- Address: 1010_111(r/w) (EEPROM)
- (near U301) Address: 1001_100(r/w)
- Route w/ guard traces (GND)
- Solens Peripherals
- ERC PASS, FOOTPRINT OK, TESPOINTED
- AY

### Library data of the parts
C300-C305 = Cap: Capacitor; DNP: DNP
  C300 C301: DigikeyPN: 490-6203-1-ND
  C302 C303: DigikeyPN: 587-3498-1-ND
  C304 C305: DigikeyPN: 490-1293-1-ND
D300 D301 D305 = LED0: Typical INFRARED GaAs LED; DNP: DNP
  D300: DigikeyPN: 732-4971-1-ND
  D301: DigikeyPN: 732-4978-1-ND; Function: LED0
  D305: DigikeyPN: 732-4978-1-ND
Q300 = 2N3904: NPN General Purpose Amplifier; DigikeyPN: MMBT3904LT1GOSCT-ND; DNP: DNP; Value: MMBT3904
R300-R304 R308 = Res1: Resistor; DNP: DNP
  R300-R302: DigikeyPN: 311-3.30KCRCT-ND
  R303 R308: DigikeyPN: 311-1.00MLRCT-ND
  R304: DigikeyPN: 311-330CRCT-ND
SJ300 SJ301 = SJ: Solder jumper; Value: SJ_0805 (DNP); DNP: DNP
TP300-TP302 TP304-TP306 = TP_SMALL: Value: TP_SMALL (DNP); DigikeyPN: 36-5015CT-ND; DNP: DNP
TP303 = TP_LARGE: Value: TP_LARGE (DNP); DigikeyPN: 36-5016CT-ND; DNP: DNP
U300 = MCP7941x: I2C RTC w/ SRAM and EEPROM; DigikeyPN: MCP79412-I/MS-ND; DNP: DNP; Value: MCP79412
U301 = EMC1412: Dual channel I2C temperature sensor; DigikeyPN: 638-1120-1-ND; DNP: DNP; Value: EMC1412
U302 = LTC2054/LTC2055: Dual zero-drift op amp; DigikeyPN: LTC2055HMS8#PBF-ND; DNP: DNP; Value: LTC2055
Y300 = XTAL-SOJ-4: LoadCapacitance: 12.5p; Value: 32k768; DigikeyPN: 535-9166-1-ND; DNP: DNP

## Sheet Camera.SchDoc
size A4; DocumentNumber: 7; SheetNumber: 7; SheetTotal: 8
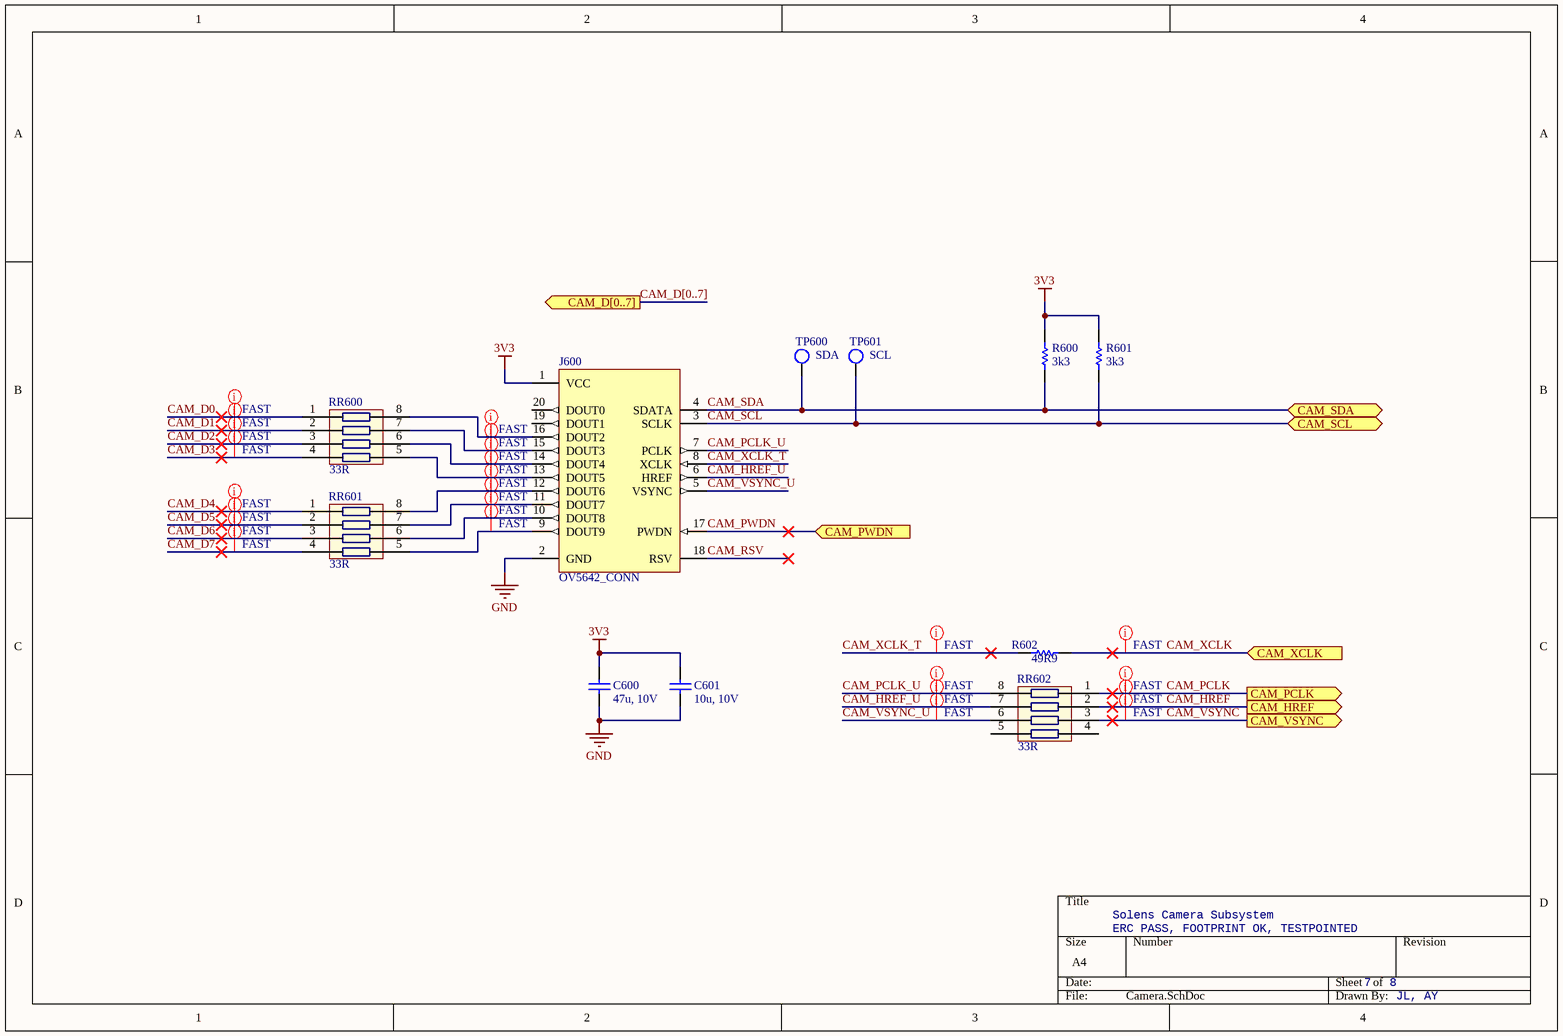
[diagram p6: Camera.SchDoc]

### Parts
C600  value 47u, 10V  [CAP_1206]  (hidden comment: 47u, 10V, 1206)
C601  value 10u, 10V  [CAP_1206]  (hidden comment: 10u, 10V, 1206)
J600  Function: OV5642_CONN  [OV5642_HDR_2x10]  (hidden comment: SOK_2x10_100TH_THT)
R600  value 3k3  [RES_0805]  (hidden comment: 3k3, 1/8W, 0805)
R601  value 3k3  [RES_0805]  (hidden comment: 3k3, 1/8W, 0805)
R602  value 49R9  [RES_0805]  (hidden comment: 49R9, 1/8W, 0805)
RR600  value 33R  [CAC-80P319X150-8M]  (hidden comment: CRA6S833CT-ND)
RR601  value 33R  [CAC-80P319X150-8M]  (hidden comment: CRA6S833CT-ND)
RR602  value 33R  [CAC-80P319X150-8M]  (hidden comment: CRA6S833CT-ND)
TP600  VisibleNetName: SDA  [TP_SMALL]  (hidden comment: TP (DNP))
TP601  VisibleNetName: SCL  [TP_SMALL]  (hidden comment: TP (DNP))

### Ports
CAM_D[0..7] (out), CAM_HREF (out), CAM_PCLK (out), CAM_PWDN (in), CAM_SCL (bidir), CAM_SDA (bidir), CAM_VSYNC (out), CAM_XCLK (in)

### Nets
3V3: C600.1 C601.1 J600.1(VCC) R600.1 R601.1
GND: C600.2 C601.2 J600.2(GND)
CAM_D0: RR600.1(1A)
CAM_D1: RR600.2(2A)
CAM_D2: RR600.3(3A)
CAM_D3: RR600.4(4A)
CAM_D4: RR601.1(1A)
CAM_D5: RR601.2(2A)
CAM_D6: RR601.3(3A)
CAM_D7: RR601.4(4A)
CAM_HREF: RR602.2(2A) ; port CAM_HREF
CAM_HREF_U: J600.6(HREF) RR602.7(2B)
CAM_PCLK: RR602.1(1A) ; port CAM_PCLK
CAM_PCLK_U: J600.7(PCLK) RR602.8(1B)
CAM_PWDN: J600.17(PWDN) ; port CAM_PWDN
CAM_RSV: J600.18(RSV)
CAM_SCL: J600.3(SCLK) R601.2 TP601.1 ; port CAM_SCL
CAM_SDA: J600.4(SDATA) R600.2 TP600.1 ; port CAM_SDA
CAM_VSYNC: RR602.3(3A) ; port CAM_VSYNC
CAM_VSYNC_U: J600.5(VSYNC) RR602.6(3B)
CAM_XCLK: R602.2 ; port CAM_XCLK
CAM_XCLK_T: J600.8(XCLK) R602.1
NetJ600_9: J600.9(DOUT9) RR601.5(4B)
NetJ600_10: J600.10(DOUT8) RR601.6(3B)
NetJ600_11: J600.11(DOUT7) RR601.7(2B)
NetJ600_12: J600.12(DOUT6) RR601.8(1B)
NetJ600_13: J600.13(DOUT5) RR600.5(4B)
NetJ600_14: J600.14(DOUT4) RR600.6(3B)
NetJ600_15: J600.15(DOUT3) RR600.7(2B)
NetJ600_16: J600.16(DOUT2) RR600.8(1B)

Not connected (* = marked no-connect by the designer): J600 19(DOUT1) 20(DOUT0); RR602 4(4A) 5(4B)

### Buses and harness runs
bus CAM_D[0..7] = port CAM_D[0..7]

### Layout directives
net class FAST: CAM_D0, CAM_D1, CAM_D2, CAM_D3, CAM_D4, CAM_D5, CAM_D6, CAM_D7, CAM_HREF, CAM_HREF_U, CAM_PCLK, CAM_PCLK_U, CAM_VSYNC, CAM_VSYNC_U, CAM_XCLK, CAM_XCLK_T, NetJ600_9, NetJ600_10, NetJ600_11, NetJ600_12, NetJ600_13, NetJ600_14, NetJ600_15, NetJ600_16

### Notes on the sheet
- Solens Camera Subsystem
- ERC PASS, FOOTPRINT OK, TESTPOINTED
- JL, AY

### Library data of the parts
C600 C601 = Cap: Capacitor
  C600: DigikeyPN: 1276-3063-1-ND
  C601: DigikeyPN: 1276-1312-1-ND
J600 = CAMERA_2x10: 20-pin parallel camera connector for OV5642; DigikeyPN: S6106-ND; Value: SOK_2x10_100TH_THT
R600-R602 = Res1: Resistor
  R600 R601: DigikeyPN: 311-3.30KCRCT-ND
  R602: DigikeyPN: 311-49.9CRCT-ND
RR600-RR602 = RES_ARR_4: 4 element resistor array; DigikeyPN: CRA6S833CT-ND
TP600 TP601 = TP_SMALL: Value: TP_SMALL (DNP); DigikeyPN: 36-5015CT-ND; DNP: DNP

## Sheet WiFi.SchDoc
size A4; DocumentNumber: 8; SheetNumber: 8; SheetTotal: 8
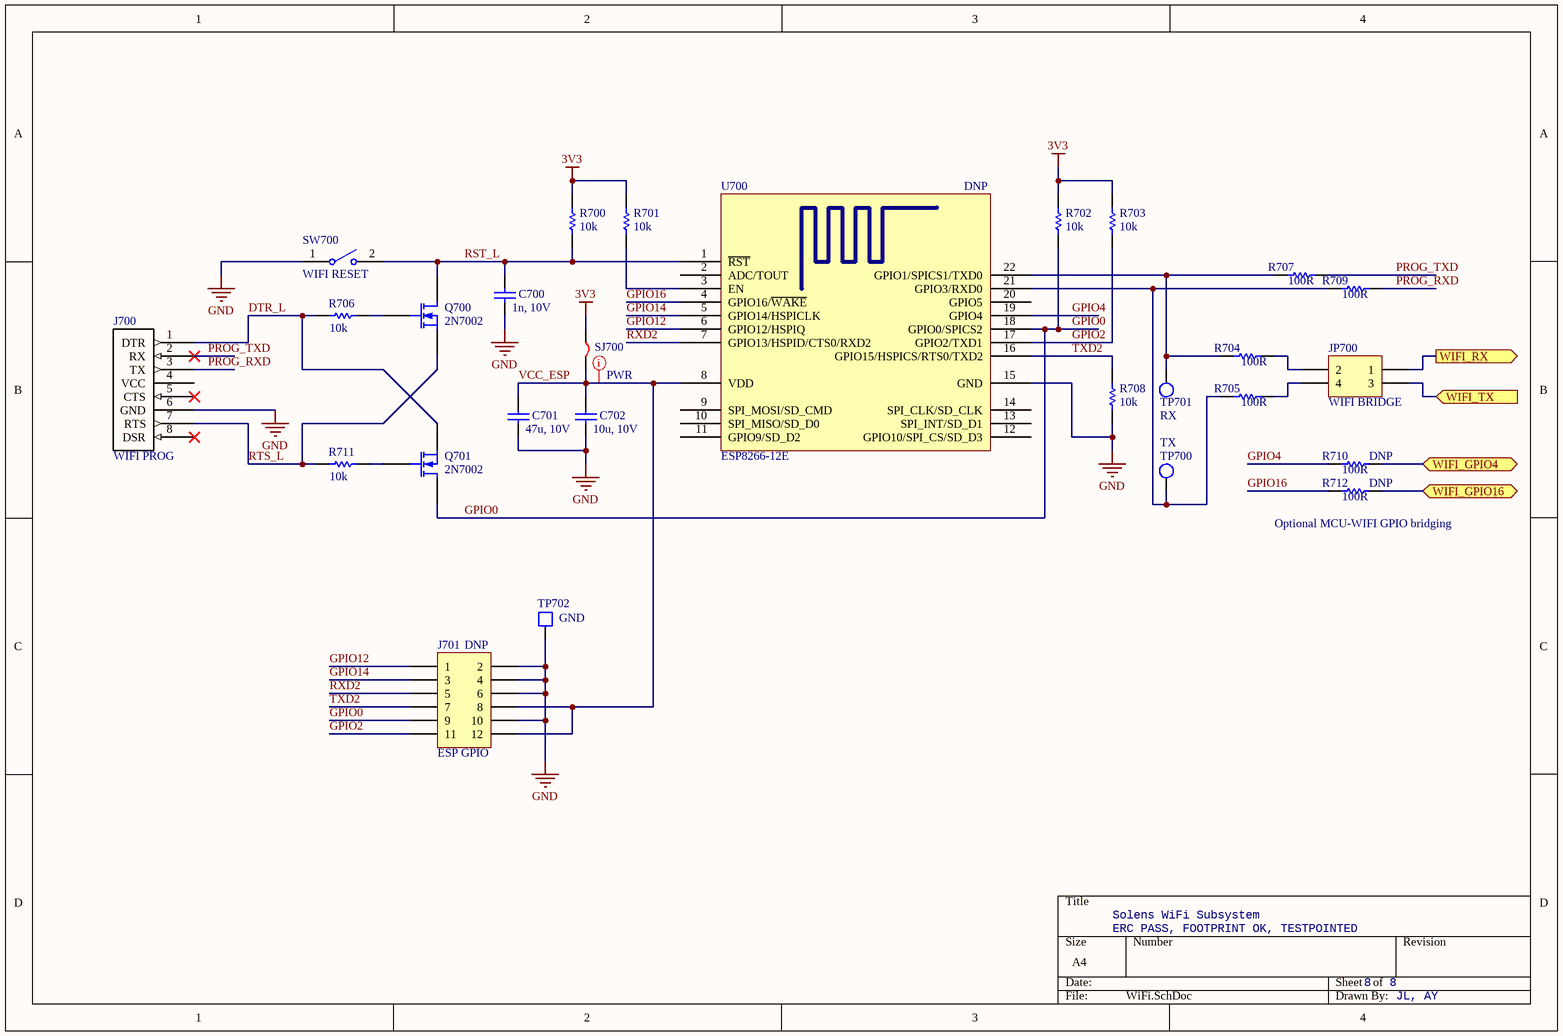
[diagram p7: WiFi.SchDoc]

### Parts
C700  value 1n, 10V  [CAP_0805]  (hidden comment: 1n, 16V, 0805)
C701  value 47u, 10V  [CAP_1206]  (hidden comment: 47u, 10V, 1206)
C702  value 10u, 10V  [CAP_1206]  (hidden comment: 10u, 10V, 1206)
J700  Function: WIFI PROG  [HDR1X8]  (hidden comment: HDR_1x8_100TH_THT)
J701  Function: ESP GPIO  [HDR_100TH_2X6_SMT]  (hidden comment: HDR_2x6_100TH_SMT (DNP))
JP700  Function: WIFI BRIDGE  [HDR2X2]  (hidden comment: HDR_2x2_100TH_THT)
Q700  PartNumber: 2N7002  [SOT95P240X100-3N (CMPSH1-4 TR)]  (hidden comment: 2N7002, SOT-23)
Q701  PartNumber: 2N7002  [SOT95P240X100-3N (CMPSH1-4 TR)]  (hidden comment: 2N7002, SOT-23)
R700  value 10k  [RES_0805]  (hidden comment: 10k, 1/8W, 0805)
R701  value 10k  [RES_0805]  (hidden comment: 10k, 1/8W, 0805)
R702  value 10k  [RES_0805]  (hidden comment: 10k, 1/8W, 0805)
R703  value 10k  [RES_0805]  (hidden comment: 10k, 1/8W, 0805)
R704  value 100R  [RES_0805]  (hidden comment: 100R, 1/8W, 0805)
R705  value 100R  [RES_0805]  (hidden comment: 100R, 1/8W, 0805)
R706  value 10k  [RES_0805]  (hidden comment: 10k, 1/8W, 0805)
R707  value 100R  [RES_0805]  (hidden comment: 100R, 1/8W, 0805)
R708  value 10k  [RES_0805]  (hidden comment: 10k, 1/8W, 0805)
R709  value 100R  [RES_0805]  (hidden comment: 100R, 1/8W, 0805)
R710  value 100R  [RES_0805]  (hidden comment: 100R, 1/8W, 0805 (DNP))
R711  value 10k  [RES_0805]  (hidden comment: 10k, 1/8W, 0805)
R712  value 100R  [RES_0805]  (hidden comment: 100R, 1/8W, 0805 (DNP))
SJ700  SJ, 1206 (DNP)  [SJ_1206]  (value not drawn)
SW700  Function: WIFI RESET  [4341x10438x6]  (hidden comment: 434121043816, TACT SPST NO)
TP700  VisibleNetName: TX  [TP_SMALL]  (hidden comment: TP (DNP))
TP701  VisibleNetName: RX  [TP_SMALL]  (hidden comment: TP (DNP))
TP702  VisibleNetName: GND  [TP_LARGE]  (hidden comment: TP (DNP))
U700  PartNumber: ESP8266-12E  [ESP8266 ESP-12-E]  (hidden comment: ESP8266-12E (DNP))

### Ports
WIFI_GPIO4 (bidir), WIFI_GPIO16 (bidir), WIFI_RX (out), WIFI_TX (in)

### Nets
3V3: R700.2 R701.2 R702.1 R703.1 SJ700.1
GND: C700.2 C701.2 C702.2 J700.6(GND) J701.2 J701.4 J701.6 J701.10 R708.1 SW700.1 TP702.1 U700.15(GND)
DTR_L: J700.1(DTR) Q701.2(S) R706.2
GPIO0: J701.9 Q701.3(D) R702.2 U700.18(GPIO0/SPICS2)
GPIO2: J701.11 R703.2 U700.17(GPIO2/TXD1)
GPIO4: R710.1 U700.19(GPIO4)
GPIO12: J701.1 U700.6(GPIO12/HSPIQ)
GPIO14: J701.3 U700.5(GPIO14/HSPICLK)
GPIO16: R712.1 U700.4(GPIO16/~{WAKE})
PROG_RXD: J700.3(TX) R709.2
PROG_TXD: J700.2(RX) R707.2
RST_L: C700.1 Q700.3(D) R700.1 SW700.2 U700.1(~{RST})
RTS_L: J700.7(RTS) Q700.2(S) R711.2
RXD2: J701.5 U700.7(GPIO13/HSPID/CTS0/RXD2)
TXD2: J701.7 R708.2 U700.16(GPIO15/HSPICS/RTS0/TXD2)
VCC_ESP: C701.1 C702.1 J701.8 J701.12 SJ700.2 U700.8(VDD)
WIFI_GPIO4: R710.2 ; port WIFI_GPIO4
WIFI_GPIO16: R712.2 ; port WIFI_GPIO16
WIFI_RX: JP700.1 ; port WIFI_RX
WIFI_TX: JP700.3 ; port WIFI_TX
NetJP700_2: JP700.2 R704.2
NetJP700_4: JP700.4 R705.2
NetQ700_1: Q700.1(G) R706.1
NetQ701_1: Q701.1(G) R711.1
NetR701_1: R701.1 U700.3(EN)
NetR704_1: R704.1 R707.1 TP701.1 U700.22(GPIO1/SPICS1/TXD0)
NetR705_1: R705.1 R709.1 TP700.1 U700.21(GPIO3/RXD0)

Not connected (* = marked no-connect by the designer): J700 4(VCC) 5(CTS)* 8(DSR)*; U700 2(ADC/TOUT) 9(SPI_MOSI/SD_CMD) 10(SPI_MISO/SD_D0) 11(GPIO9/SD_D2) 12(GPIO10/SPI_CS/SD_D3) 13(SPI_INT/SD_D1) 14(SPI_CLK/SD_CLK) 20(GPIO5)

### Layout directives
net class PWR: VCC_ESP

### Notes on the sheet
- (near R712) Optional MCU-WIFI GPIO bridging
- Solens WiFi Subsystem
- ERC PASS, FOOTPRINT OK, TESTPOINTED
- JL, AY

### Library data of the parts
C700-C702 = Cap: Capacitor
  C700: DigikeyPN: 1276-1020-1-ND
  C701: DigikeyPN: 1276-3063-1-ND
  C702: DigikeyPN: 1276-1312-1-ND
J700 = HDR_FTDI_EXTENDED: DigikeyPN: 609-3264-ND; Value: HDR_1x8_100TH_THT
J701 = Header 6X2: Header, 6-Pin, Dual row; DigikeyPN: WM17452-ND; DNP: DNP; Value: HDR_2x6_100TH_SMT
JP700 = Header 2X2: Header, 2-Pin, Dual row; DigikeyPN: 609-3201-ND; Value: HDR_2x2_100TH_THT
Q700 Q701 = MOSFET-N: N-Channel MOSFET; PackageName: SOT23; DigikeyPN: 568-5818-1-ND; Value: 2N7002
R700-R712 = Res1: Resistor
  R700-R703 R706 R708 R711: DigikeyPN: 311-10.0KCRCT-ND
  R704 R705 R707 R709: DigikeyPN: 311-100CRCT-ND
  R710 R712: DigikeyPN: 311-100CRCT-ND; DNP: DNP
SJ700 = SJ: Solder jumper; Value: SJ_1206 (DNP); DNP: DNP
SW700 = WS-TASV, 434121043816: WS-TASV 6.0x3.5 mm SMD; Manufacturer: Wurth Elektronik; PartNumber: 434121043816; ComponentLink1URL: http://www.we-online.de; Created by: Baojun Chen; Created Date: Dec.2015; ComponentLink2URL: http://katalog.we-online.de/em/datasheet/4341x1xxx8x6.pdf; DigikeyPN: 732-7046-1-ND; Value: 434121043816
TP700 TP701 = TP_SMALL: Value: TP_SMALL (DNP); DigikeyPN: 36-5015CT-ND; DNP: DNP
TP702 = TP_LARGE: Value: TP_LARGE (DNP); DigikeyPN: 36-5016CT-ND; DNP: DNP
U700 = ESP8266 ESP-12-E: DNP: DNP; Value: ESP8266-12E

## Nets that join several sheets
3V3: Regulators (5 pins), SDRAM (15 pins), MCU (37 pins), Peripherals (5 pins), Camera (5 pins), WiFi (5 pins)
GND: Solens (MTGH1.1 MTGH2.1 MTGH3.1 MTGH4.1), SolarCharger (20 pins), Regulators (14 pins), SDRAM (16 pins), MCU (55 pins), Peripherals (13 pins), Camera (C600.2 C601.2 J600.2), WiFi (12 pins)
3V3_PG: Regulators (R402.1 U400.8), MCU (U100.110)
CAM_D0: MCU (U100.96), Camera (RR600.1)
CAM_D1: MCU (U100.97), Camera (RR600.2)
CAM_D2: MCU (U100.98), Camera (RR600.3)
CAM_D3: MCU (U100.126), Camera (RR600.4)
CAM_D4: MCU (U100.112), Camera (RR601.1)
CAM_D5: MCU (U100.117), Camera (RR601.2)
CAM_D6: MCU (U100.4), Camera (RR601.3)
CAM_D7: MCU (U100.5), Camera (RR601.4)
CAM_HREF: MCU (U100.40), Camera (RR602.2)
CAM_PCLK: MCU (U100.42), Camera (RR602.1)
CAM_PWDN: MCU (U100.87), Camera (J600.17)
CAM_SCL: MCU (U100.139), Camera (J600.3 R601.2 TP601.1)
CAM_SDA: MCU (U100.140), Camera (J600.4 R600.2 TP600.1)
CAM_VSYNC: MCU (U100.124), Camera (RR602.3)
CAM_XCLK: MCU (U100.100), Camera (R602.2)
I2C2_ALERT: SolarCharger (U203.6), MCU (U100.73), Peripherals (R302.2 TP302.1 U300.7 U301.6)
I2C2_SCL: SolarCharger (U203.4), MCU (U100.69), Peripherals (R301.2 TP301.1 U300.6 U301.8)
I2C2_SDA: SolarCharger (U203.5), MCU (U100.70), Peripherals (R300.2 TP300.1 U300.5 U301.7)
LED0: MCU (J102.9 U100.88), Peripherals (R304.1 TP306.1)
PV_SHDN_L: SolarCharger (JP200.3), MCU (U100.127)
PV_VIN_SENS: SolarCharger (C207.1 R206.2 R208.1), MCU (U100.27)
PWR_CHRG_L: SolarCharger (D203.2 TP208.1 U200.4), MCU (U100.128)
PWR_FAULT_L: SolarCharger (D204.2 TP209.1 U200.5), MCU (U100.129)
SD_A0: SDRAM (RR507.8), MCU (U100.10)
SD_A1: SDRAM (RR507.7), MCU (U100.11)
SD_A2: SDRAM (RR507.6), MCU (U100.12)
SD_A3: SDRAM (RR507.5), MCU (U100.13)
SD_A4: SDRAM (RR501.8), MCU (U100.14)
SD_A5: SDRAM (RR501.7), MCU (U100.15)
SD_A6: SDRAM (RR508.6), MCU (U100.50)
SD_A7: SDRAM (RR508.5), MCU (U100.53)
SD_A8: SDRAM (RR502.8), MCU (U100.54)
SD_A9: SDRAM (RR502.7), MCU (U100.55)
SD_A10: SDRAM (RR502.6), MCU (U100.56)
SD_A11: SDRAM (RR502.5), MCU (U100.57)
SD_BA0: SDRAM (RR508.8), MCU (U100.89)
SD_BA1: SDRAM (RR508.7), MCU (U100.90)
SD_CKE1: SDRAM (RR500.8), MCU (U100.135)
SD_CLK: SDRAM (R502.1), MCU (U100.93)
SD_D0: SDRAM (RR505.8), MCU (U100.85)
SD_D1: SDRAM (RR505.7), MCU (U100.86)
SD_D2: SDRAM (RR505.6), MCU (U100.114)
SD_D3: SDRAM (RR505.5), MCU (U100.115)
SD_D4: SDRAM (RR504.8), MCU (U100.58)
SD_D5: SDRAM (RR504.7), MCU (U100.59)
SD_D6: SDRAM (RR504.6), MCU (U100.60)
SD_D7: SDRAM (RR504.5), MCU (U100.63)
SD_D8: SDRAM (RR503.1), MCU (U100.64)
SD_D9: SDRAM (RR503.2), MCU (U100.65)
SD_D10: SDRAM (RR503.3), MCU (U100.66)
SD_D11: SDRAM (RR503.4), MCU (U100.67)
SD_D12: SDRAM (RR506.8), MCU (U100.68)
SD_D13: SDRAM (RR506.7), MCU (U100.77)
SD_D14: SDRAM (RR506.6), MCU (U100.78)
SD_D15: SDRAM (RR506.5), MCU (U100.79)
SD_NBL0: SDRAM (RR500.6), MCU (U100.141)
SD_NBL1: SDRAM (RR500.5), MCU (U100.142)
SD_NCAS: SDRAM (R501.1), MCU (U100.132)
SD_NE1: SDRAM (RR500.7), MCU (U100.136)
SD_NRAS: SDRAM (R500.1), MCU (U100.49)
SD_NWE: SDRAM (RR501.6), MCU (U100.26)
SPECT0: MCU (U100.44), Peripherals (C305.2 R308.2 TP304.1 U302.1)
SPECT1: MCU (U100.45), Peripherals (C304.1 R303.1 TP305.1 U302.7)
VBAT_INT: SolarCharger (11 pins), Regulators (C401.1 C402.1 U400.9 U400.10)
WIFI_GPIO4: MCU (U100.118), WiFi (R710.2)
WIFI_GPIO16: MCU (U100.119), WiFi (R712.2)
WIFI_RX: MCU (U100.137), WiFi (JP700.1)
WIFI_TX: MCU (U100.101), WiFi (JP700.3)